# EAGLE design watchV2 (EAGLE 9.5.2)
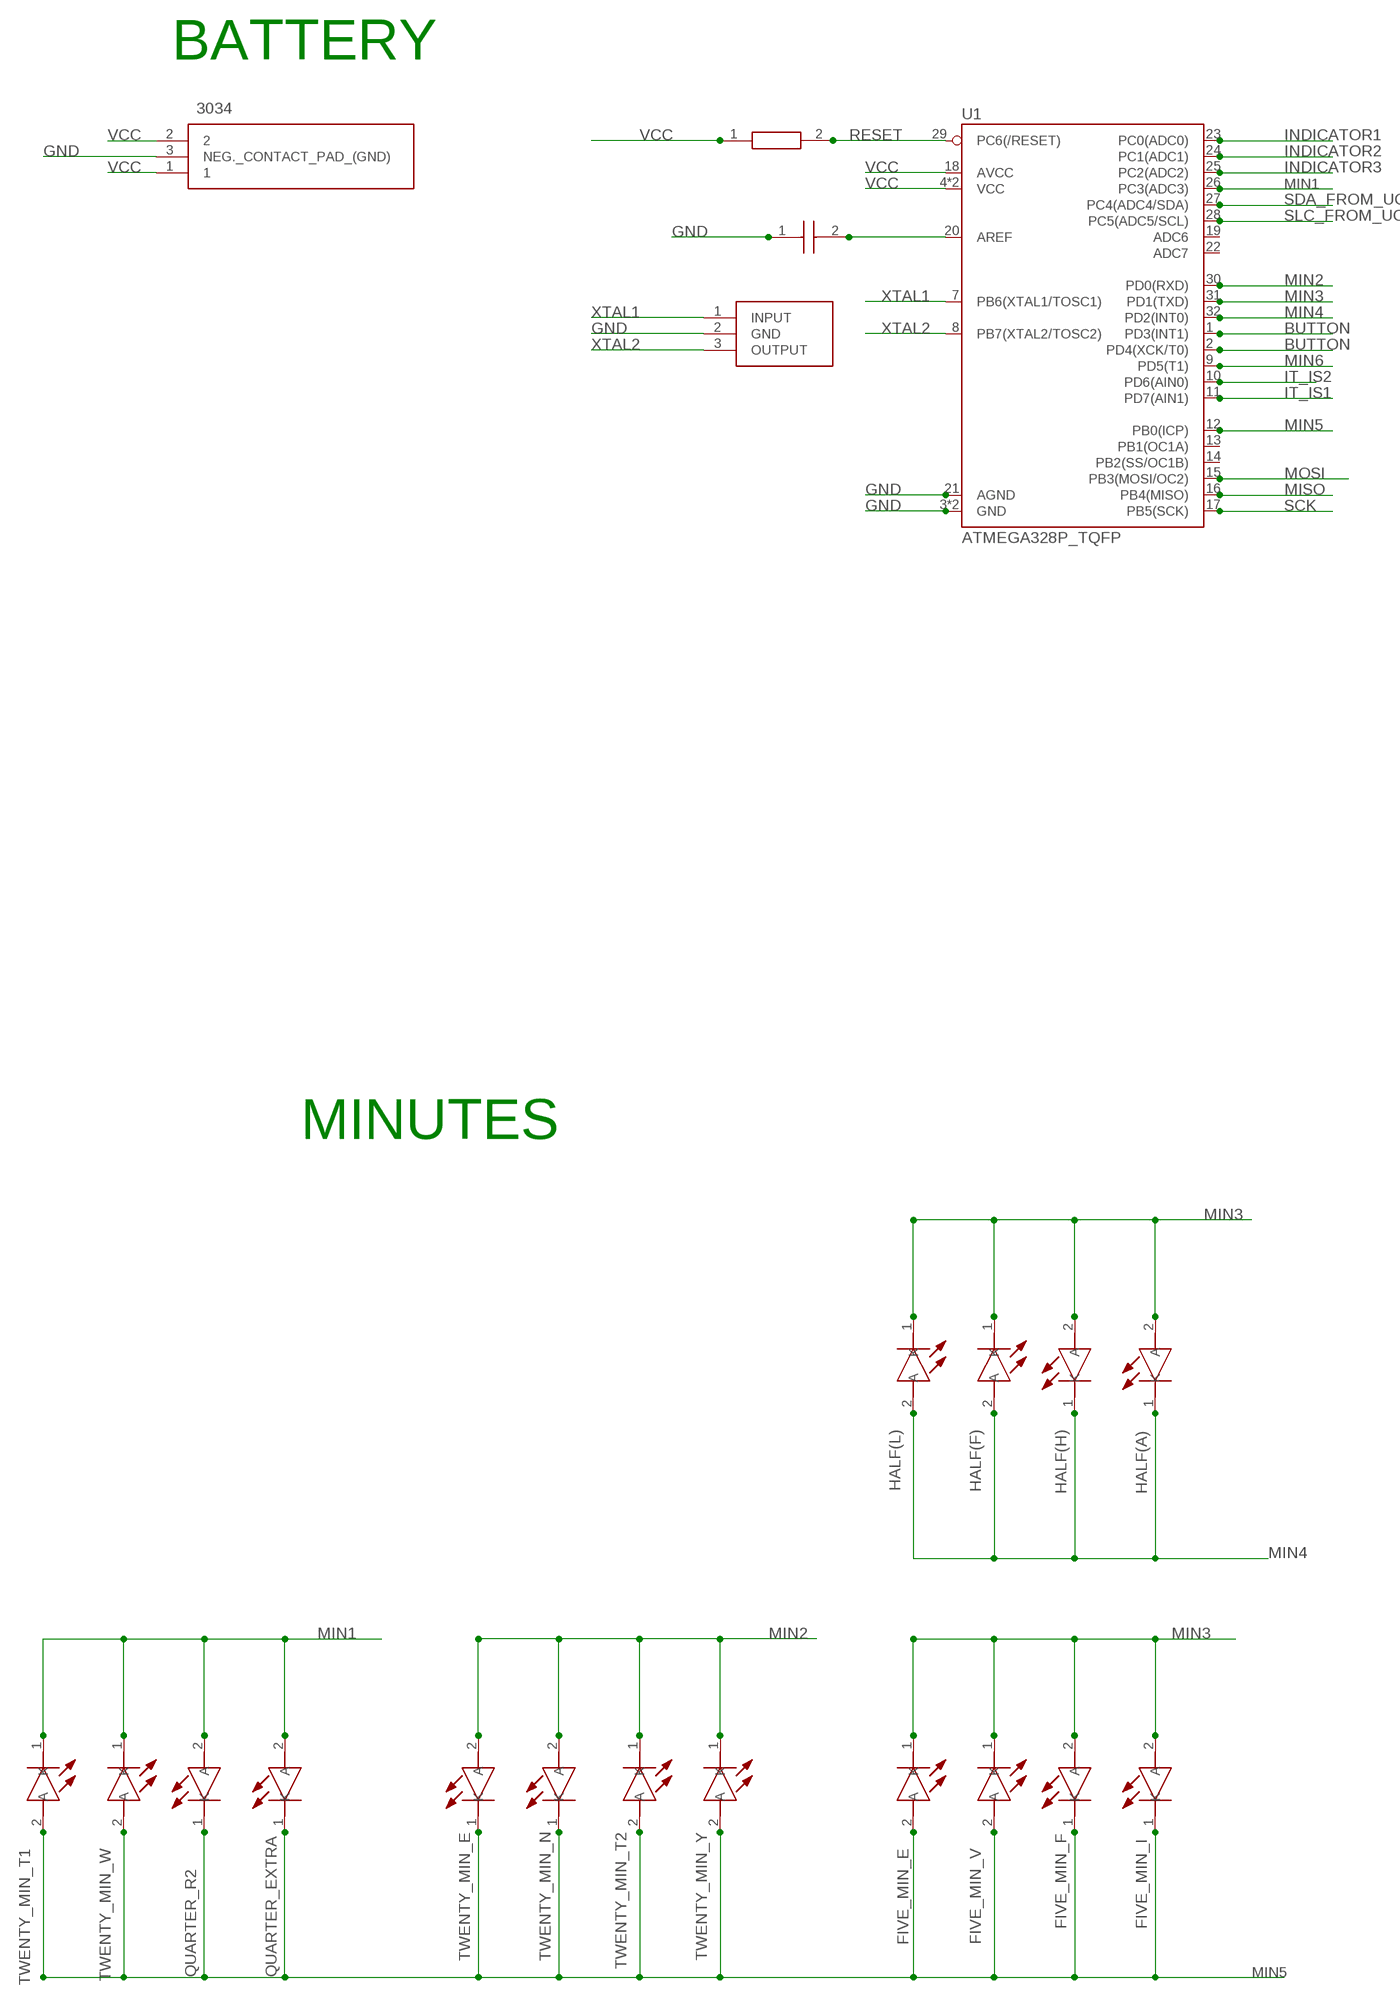
[diagram p0: schematic, sheet 1, part 1 of 3]
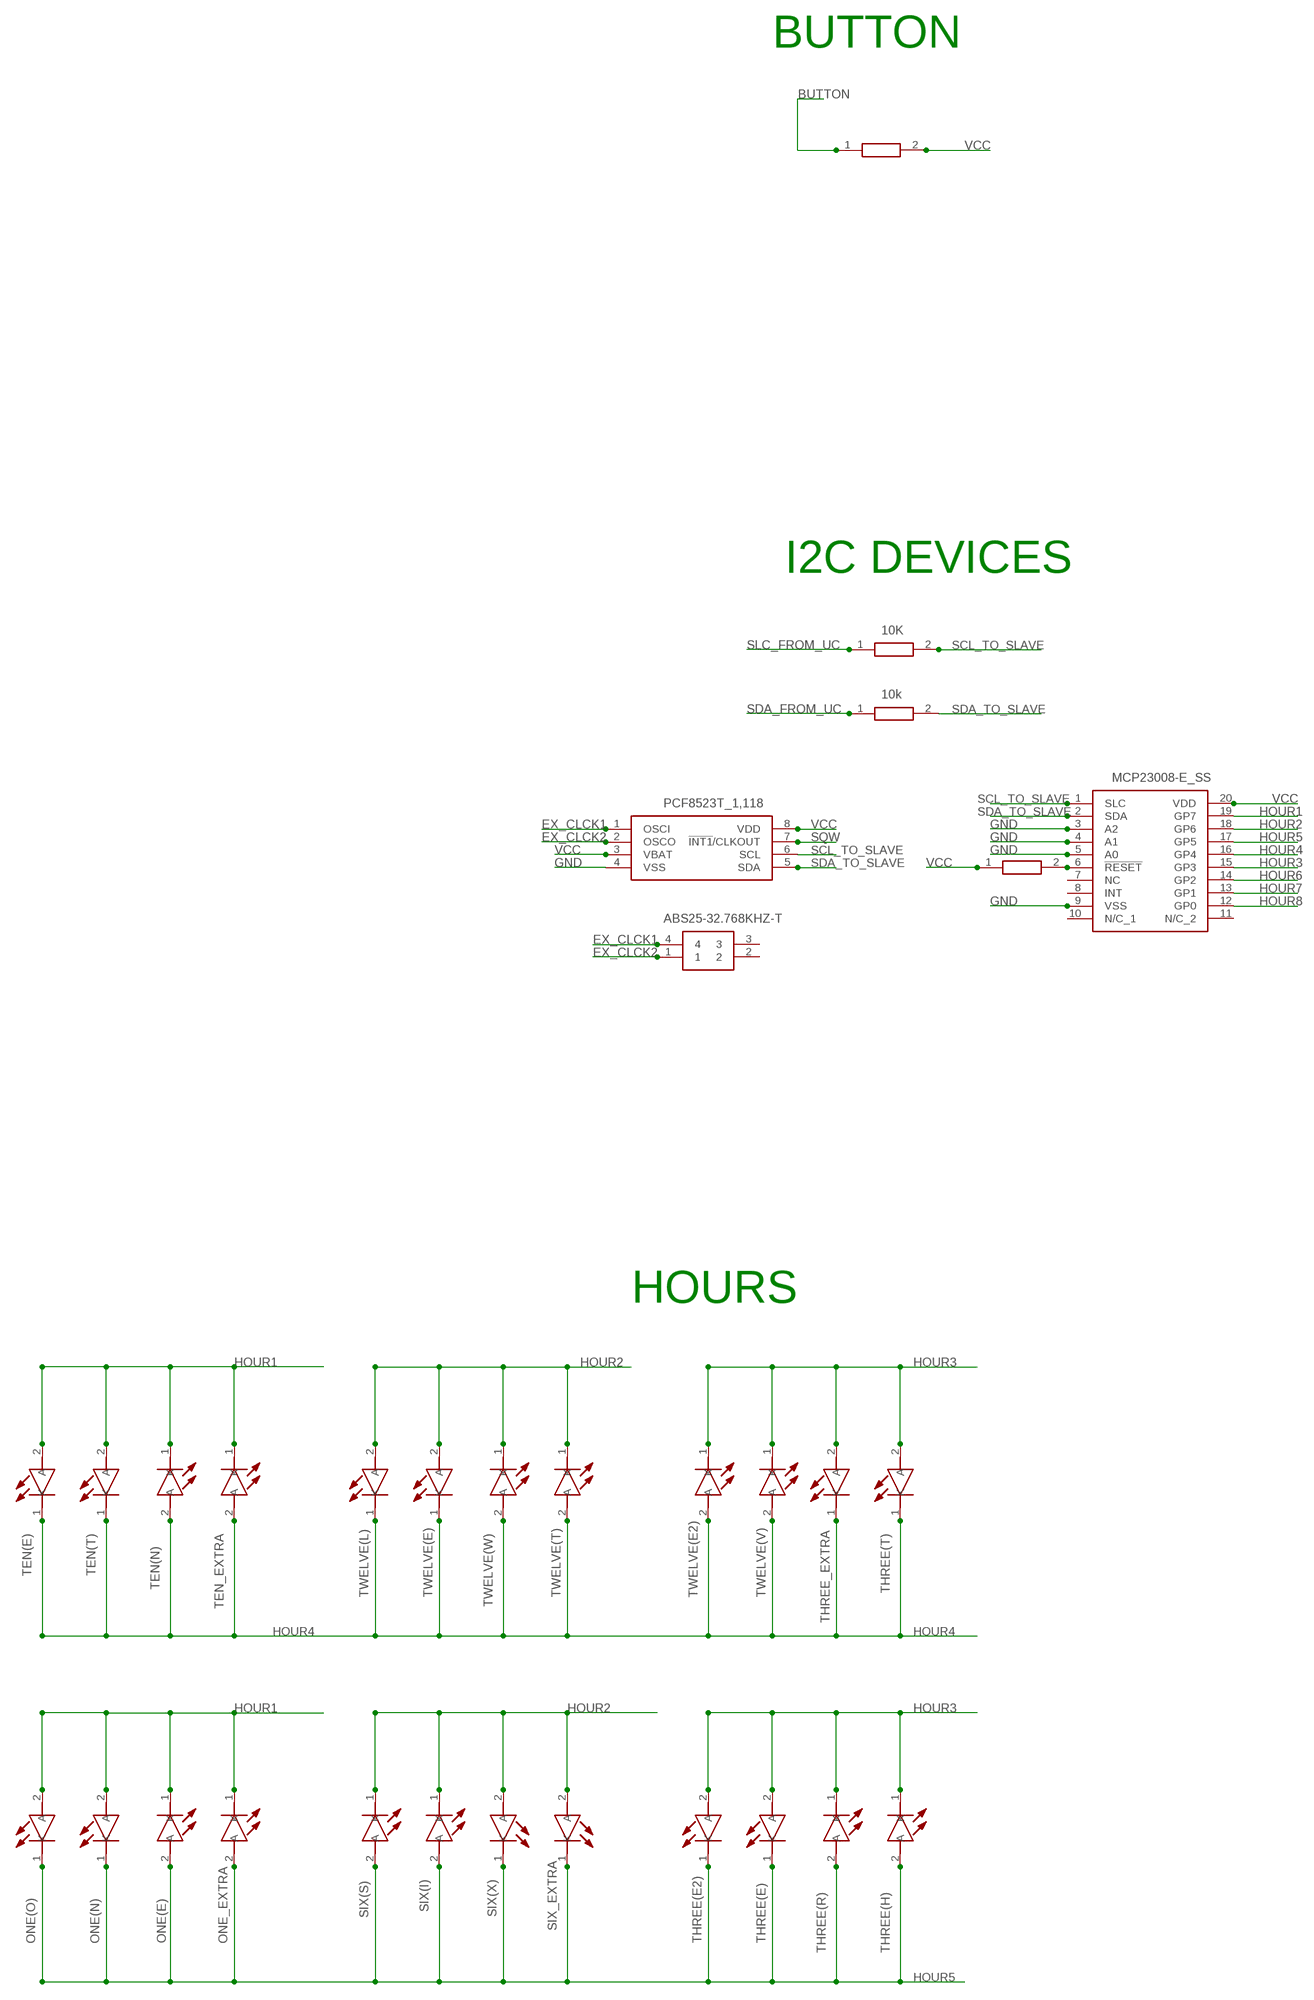
[diagram p1: schematic, sheet 1, part 2 of 3]
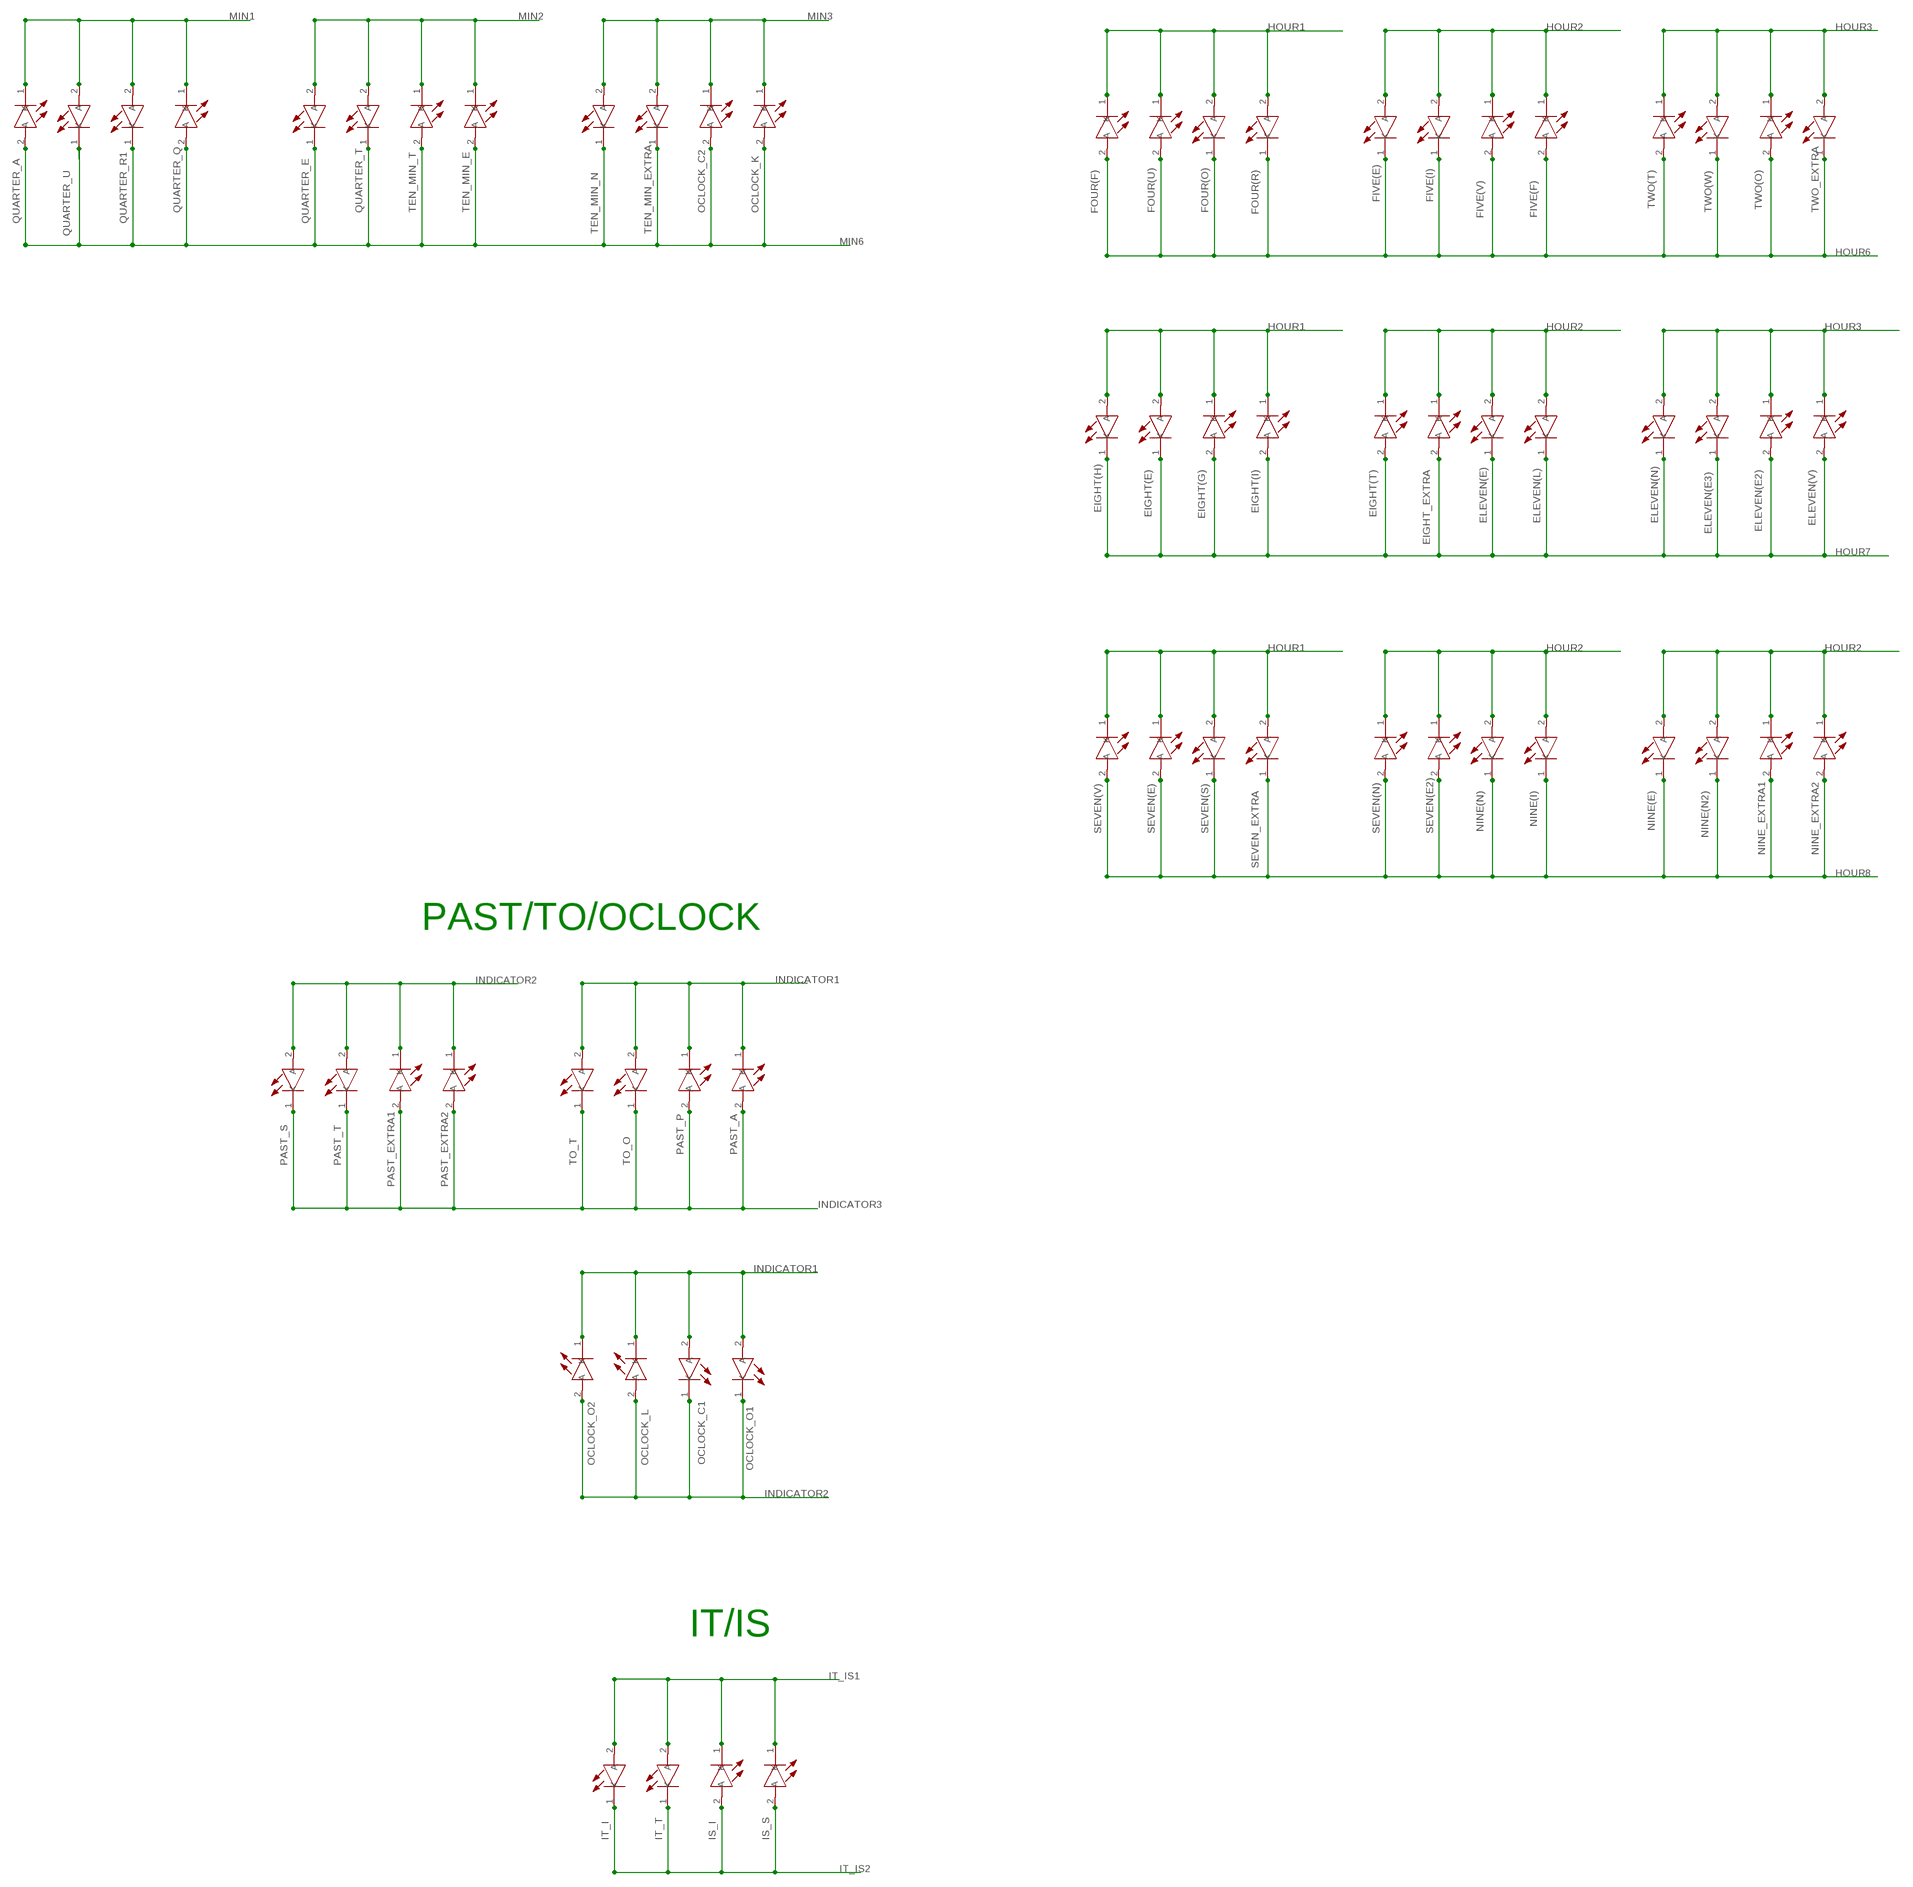
[diagram p2: schematic, sheet 1, part 3 of 3]

## Parts
10K  RC0402FR-0722RL  [RESC1005X40N]
C1  C0402C104Z4VAC  [CAPC1005X55N]
EIGHT(E)  APHHS1005CGCK  [LEDC1005X60N]
EIGHT(G)  APHHS1005CGCK  [LEDC1005X60N]
EIGHT(H)  APHHS1005CGCK  [LEDC1005X60N]
EIGHT(I)  APHHS1005CGCK  [LEDC1005X60N]
EIGHT(T)  APHHS1005CGCK  [LEDC1005X60N]
EIGHT_EXTRA  APHHS1005CGCK  [LEDC1005X60N]
ELEVEN(E2)  APHHS1005CGCK  [LEDC1005X60N]
ELEVEN(E3)  APHHS1005CGCK  [LEDC1005X60N]
ELEVEN(E)  APHHS1005CGCK  [LEDC1005X60N]
ELEVEN(L)  APHHS1005CGCK  [LEDC1005X60N]
ELEVEN(N)  APHHS1005CGCK  [LEDC1005X60N]
ELEVEN(V)  APHHS1005CGCK  [LEDC1005X60N]
FIVE(E)  APHHS1005CGCK  [LEDC1005X60N]
FIVE(F)  APHHS1005CGCK  [LEDC1005X60N]
FIVE(I)  APHHS1005CGCK  [LEDC1005X60N]
FIVE(V)  APHHS1005CGCK  [LEDC1005X60N]
FIVE_MIN_E  APHHS1005CGCK  [LEDC1005X60N]
FIVE_MIN_F  APHHS1005CGCK  [LEDC1005X60N]
FIVE_MIN_I  APHHS1005CGCK  [LEDC1005X60N]
FIVE_MIN_V  APHHS1005CGCK  [LEDC1005X60N]
FOUR(F)  APHHS1005CGCK  [LEDC1005X60N]
FOUR(O)  APHHS1005CGCK  [LEDC1005X60N]
FOUR(R)  APHHS1005CGCK  [LEDC1005X60N]
FOUR(U)  APHHS1005CGCK  [LEDC1005X60N]
HALF(A)  APHHS1005CGCK  [LEDC1005X60N]
HALF(F)  APHHS1005CGCK  [LEDC1005X60N]
HALF(H)  APHHS1005CGCK  [LEDC1005X60N]
HALF(L)  APHHS1005CGCK  [LEDC1005X60N]
IC1  MCP23008-E_SS  [SOP65P780X200-20N]
IC2  CSTNE16M0VH3C000R0  [CSTNE16M0VH3C000R0]
IC3  PCF8523T_1,118  [SOIC127P600X175-8N]
IS_I  APHHS1005CGCK  [LEDC1005X60N]
IS_S  APHHS1005CGCK  [LEDC1005X60N]
IT_I  APHHS1005CGCK  [LEDC1005X60N]
IT_T  APHHS1005CGCK  [LEDC1005X60N]
NINE(E)  APHHS1005CGCK  [LEDC1005X60N]
NINE(I)  APHHS1005CGCK  [LEDC1005X60N]
NINE(N2)  APHHS1005CGCK  [LEDC1005X60N]
NINE(N)  APHHS1005CGCK  [LEDC1005X60N]
NINE_EXTRA1  APHHS1005CGCK  [LEDC1005X60N]
NINE_EXTRA2  APHHS1005CGCK  [LEDC1005X60N]
OCLOCK_C1  APHHS1005CGCK  [LEDC1005X60N]
OCLOCK_C2  APHHS1005CGCK  [LEDC1005X60N]
OCLOCK_K  APHHS1005CGCK  [LEDC1005X60N]
OCLOCK_L  APHHS1005CGCK  [LEDC1005X60N]
OCLOCK_O1  APHHS1005CGCK  [LEDC1005X60N]
OCLOCK_O2  APHHS1005CGCK  [LEDC1005X60N]
ONE(E)  APHHS1005CGCK  [LEDC1005X60N]
ONE(N)  APHHS1005CGCK  [LEDC1005X60N]
ONE(O)  APHHS1005CGCK  [LEDC1005X60N]
ONE_EXTRA  APHHS1005CGCK  [LEDC1005X60N]
PAST_A  APHHS1005CGCK  [LEDC1005X60N]
PAST_EXTRA1  48ohm  APHHS1005CGCK  [LEDC1005X60N]
PAST_EXTRA2  APHHS1005CGCK  [LEDC1005X60N]
PAST_P  48ohm  APHHS1005CGCK  [LEDC1005X60N]
PAST_S  APHHS1005CGCK  [LEDC1005X60N]
PAST_T  APHHS1005CGCK  [LEDC1005X60N]
QUARTER_A  APHHS1005CGCK  [LEDC1005X60N]
QUARTER_E  APHHS1005CGCK  [LEDC1005X60N]
QUARTER_EXTRA  APHHS1005CGCK  [LEDC1005X60N]
QUARTER_Q  APHHS1005CGCK  [LEDC1005X60N]
QUARTER_R1  APHHS1005CGCK  [LEDC1005X60N]
QUARTER_R2  APHHS1005CGCK  [LEDC1005X60N]
QUARTER_T  APHHS1005CGCK  [LEDC1005X60N]
QUARTER_U  APHHS1005CGCK  [LEDC1005X60N]
RED1  RC0402FR-0722RL  [RESC1005X40N]
RED2  RC0402FR-0722RL  [RESC1005X40N]
RED5  RC0402FR-0722RL  [RESC1005X40N]
RED7  10k  RC0402FR-0722RL  [RESC1005X40N]
SEVEN(E2)  APHHS1005CGCK  [LEDC1005X60N]
SEVEN(E)  APHHS1005CGCK  [LEDC1005X60N]
SEVEN(N)  APHHS1005CGCK  [LEDC1005X60N]
SEVEN(S)  APHHS1005CGCK  [LEDC1005X60N]
SEVEN(V)  APHHS1005CGCK  [LEDC1005X60N]
SEVEN_EXTRA  APHHS1005CGCK  [LEDC1005X60N]
SIX(I)  APHHS1005CGCK  [LEDC1005X60N]
SIX(S)  APHHS1005CGCK  [LEDC1005X60N]
SIX(X)  APHHS1005CGCK  [LEDC1005X60N]
SIX_EXTRA  APHHS1005CGCK  [LEDC1005X60N]
TEN(E)  APHHS1005CGCK  [LEDC1005X60N]
TEN(N)  APHHS1005CGCK  [LEDC1005X60N]
TEN(T)  APHHS1005CGCK  [LEDC1005X60N]
TEN_EXTRA  APHHS1005CGCK  [LEDC1005X60N]
TEN_MIN_E  APHHS1005CGCK  [LEDC1005X60N]
TEN_MIN_EXTRA  APHHS1005CGCK  [LEDC1005X60N]
TEN_MIN_N  APHHS1005CGCK  [LEDC1005X60N]
TEN_MIN_T  APHHS1005CGCK  [LEDC1005X60N]
THREE(E2)  APHHS1005CGCK  [LEDC1005X60N]
THREE(E)  APHHS1005CGCK  [LEDC1005X60N]
THREE(H)  APHHS1005CGCK  [LEDC1005X60N]
THREE(R)  APHHS1005CGCK  [LEDC1005X60N]
THREE(T)  APHHS1005CGCK  [LEDC1005X60N]
THREE_EXTRA  APHHS1005CGCK  [LEDC1005X60N]
TO_O  APHHS1005CGCK  [LEDC1005X60N]
TO_T  APHHS1005CGCK  [LEDC1005X60N]
TWELVE(E2)  APHHS1005CGCK  [LEDC1005X60N]
TWELVE(E)  APHHS1005CGCK  [LEDC1005X60N]
TWELVE(L)  APHHS1005CGCK  [LEDC1005X60N]
TWELVE(T)  APHHS1005CGCK  [LEDC1005X60N]
TWELVE(V)  APHHS1005CGCK  [LEDC1005X60N]
TWELVE(W)  APHHS1005CGCK  [LEDC1005X60N]
TWENTY_MIN_E  APHHS1005CGCK  [LEDC1005X60N]
TWENTY_MIN_N  APHHS1005CGCK  [LEDC1005X60N]
TWENTY_MIN_T1  APHHS1005CGCK  [LEDC1005X60N]
TWENTY_MIN_T2  APHHS1005CGCK  [LEDC1005X60N]
TWENTY_MIN_W  APHHS1005CGCK  [LEDC1005X60N]
TWENTY_MIN_Y  APHHS1005CGCK  [LEDC1005X60N]
TWO(O)  APHHS1005CGCK  [LEDC1005X60N]
TWO(T)  APHHS1005CGCK  [LEDC1005X60N]
TWO(W)  APHHS1005CGCK  [LEDC1005X60N]
TWO_EXTRA  APHHS1005CGCK  [LEDC1005X60N]
U1  ATMEGA328P_TQFP  [TQFP32-08]
U2  3034  [3034]
Y1  ABS25-32.768KHZ-T  [ABS2532768KHZT]

## Nets
BUTTON: RED1.1 U1.1(PD3(INT1)) U1.2(PD4(XCK/T0))
EX_CLCK1: IC3.1(OSCI) Y1.4
EX_CLCK2: IC3.2(OSCO) Y1.1
GND: C1.1 IC1.3(A2) IC1.4(A1) IC1.5(A0) IC1.9(VSS) IC2.2(GND) IC3.4(VSS) U1.3(GND) U1.5(GND) U1.21(AGND) U2.3(NEG._CONTACT_PAD_(GND))
HOUR1: EIGHT(E).2(A) EIGHT(G).1(K) EIGHT(H).2(A) EIGHT(I).1(K) FOUR(F).1(K) FOUR(O).2(A) FOUR(R).2(A) FOUR(U).1(K) IC1.19(GP7) ONE(E).1(K) ONE(N).2(A) ONE(O).2(A) ONE_EXTRA.1(K) SEVEN(E).1(K) SEVEN(S).2(A) SEVEN(V).1(K) SEVEN_EXTRA.2(A) TEN(E).2(A) TEN(N).1(K) TEN(T).2(A) TEN_EXTRA.1(K)
HOUR2: EIGHT(T).1(K) EIGHT_EXTRA.1(K) ELEVEN(E).2(A) ELEVEN(L).2(A) FIVE(E).2(A) FIVE(F).1(K) FIVE(I).2(A) FIVE(V).1(K) IC1.18(GP6) NINE(E).2(A) NINE(I).2(A) NINE(N2).2(A) NINE(N).2(A) NINE_EXTRA1.1(K) NINE_EXTRA2.1(K) SEVEN(E2).1(K) SEVEN(N).1(K) SIX(I).1(K) SIX(S).1(K) SIX(X).2(A) SIX_EXTRA.2(A) TWELVE(E).2(A) TWELVE(L).2(A) TWELVE(T).1(K) TWELVE(W).1(K)
HOUR3: ELEVEN(E2).1(K) ELEVEN(E3).2(A) ELEVEN(N).2(A) ELEVEN(V).1(K) IC1.15(GP3) THREE(E2).2(A) THREE(E).2(A) THREE(H).1(K) THREE(R).1(K) THREE(T).2(A) THREE_EXTRA.2(A) TWELVE(E2).1(K) TWELVE(V).1(K) TWO(O).1(K) TWO(T).1(K) TWO(W).2(A) TWO_EXTRA.2(A)
HOUR4: IC1.16(GP4) TEN(E).1(K) TEN(N).2(A) TEN(T).1(K) TEN_EXTRA.2(A) THREE(T).1(K) THREE_EXTRA.1(K) TWELVE(E2).2(A) TWELVE(E).1(K) TWELVE(L).1(K) TWELVE(T).2(A) TWELVE(V).2(A) TWELVE(W).2(A)
HOUR5: IC1.17(GP5) ONE(E).2(A) ONE(N).1(K) ONE(O).1(K) ONE_EXTRA.2(A) SIX(I).2(A) SIX(S).2(A) SIX(X).1(K) SIX_EXTRA.1(K) THREE(E2).1(K) THREE(E).1(K) THREE(H).2(A) THREE(R).2(A)
HOUR6: FIVE(E).1(K) FIVE(F).2(A) FIVE(I).1(K) FIVE(V).2(A) FOUR(F).2(A) FOUR(O).1(K) FOUR(R).1(K) FOUR(U).2(A) IC1.14(GP2) TWO(O).2(A) TWO(T).2(A) TWO(W).1(K) TWO_EXTRA.1(K)
HOUR7: EIGHT(E).1(K) EIGHT(G).2(A) EIGHT(H).1(K) EIGHT(I).2(A) EIGHT(T).2(A) EIGHT_EXTRA.2(A) ELEVEN(E2).2(A) ELEVEN(E3).1(K) ELEVEN(E).1(K) ELEVEN(L).1(K) ELEVEN(N).1(K) ELEVEN(V).2(A) IC1.13(GP1)
HOUR8: IC1.12(GP0) NINE(E).1(K) NINE(I).1(K) NINE(N2).1(K) NINE(N).1(K) NINE_EXTRA1.2(A) NINE_EXTRA2.2(A) SEVEN(E2).2(A) SEVEN(E).2(A) SEVEN(N).2(A) SEVEN(S).1(K) SEVEN(V).2(A) SEVEN_EXTRA.1(K)
INDICATOR1: OCLOCK_C1.2(A) OCLOCK_L.1(K) OCLOCK_O1.2(A) OCLOCK_O2.1(K) PAST_A.1(K) PAST_P.1(K) TO_O.2(A) TO_T.2(A) U1.23(PC0(ADC0))
INDICATOR2: OCLOCK_C1.1(K) OCLOCK_L.2(A) OCLOCK_O1.1(K) OCLOCK_O2.2(A) PAST_EXTRA1.1(K) PAST_EXTRA2.1(K) PAST_S.2(A) PAST_T.2(A) U1.24(PC1(ADC1))
INDICATOR3: PAST_A.2(A) PAST_EXTRA1.2(A) PAST_EXTRA2.2(A) PAST_P.2(A) PAST_S.1(K) PAST_T.1(K) TO_O.1(K) TO_T.1(K) U1.25(PC2(ADC2))
IT_IS1: IS_I.1(K) IS_S.1(K) IT_I.2(A) IT_T.2(A) U1.11(PD7(AIN1))
IT_IS2: IS_I.2(A) IS_S.2(A) IT_I.1(K) IT_T.1(K) U1.10(PD6(AIN0))
MIN1: QUARTER_A.1(K) QUARTER_EXTRA.2(A) QUARTER_Q.1(K) QUARTER_R1.2(A) QUARTER_R2.2(A) QUARTER_U.2(A) TWENTY_MIN_T1.1(K) TWENTY_MIN_W.1(K) U1.26(PC3(ADC3))
MIN2: QUARTER_E.2(A) QUARTER_T.2(A) TEN_MIN_E.1(K) TEN_MIN_T.1(K) TWENTY_MIN_E.2(A) TWENTY_MIN_N.2(A) TWENTY_MIN_T2.1(K) TWENTY_MIN_Y.1(K) U1.30(PD0(RXD))
MIN3: FIVE_MIN_E.1(K) FIVE_MIN_F.2(A) FIVE_MIN_I.2(A) FIVE_MIN_V.1(K) HALF(A).2(A) HALF(F).1(K) HALF(H).2(A) HALF(L).1(K) OCLOCK_C2.1(K) OCLOCK_K.1(K) TEN_MIN_EXTRA.2(A) TEN_MIN_N.2(A) U1.31(PD1(TXD))
MIN4: HALF(A).1(K) HALF(F).2(A) HALF(H).1(K) HALF(L).2(A) U1.32(PD2(INT0))
MIN5: FIVE_MIN_E.2(A) FIVE_MIN_F.1(K) FIVE_MIN_I.1(K) FIVE_MIN_V.2(A) QUARTER_EXTRA.1(K) QUARTER_R2.1(K) TWENTY_MIN_E.1(K) TWENTY_MIN_N.1(K) TWENTY_MIN_T1.2(A) TWENTY_MIN_T2.2(A) TWENTY_MIN_W.2(A) TWENTY_MIN_Y.2(A) U1.12(PB0(ICP))
MIN6: OCLOCK_C2.2(A) OCLOCK_K.2(A) QUARTER_A.2(A) QUARTER_E.1(K) QUARTER_Q.2(A) QUARTER_R1.1(K) QUARTER_T.1(K) QUARTER_U.1(K) TEN_MIN_E.2(A) TEN_MIN_EXTRA.1(K) TEN_MIN_N.1(K) TEN_MIN_T.2(A) U1.9(PD5(T1))
MISO: U1.16(PB4(MISO))
MOSI: U1.15(PB3(MOSI/OC2))
N$1: IC1.6(!RESET) RED2.2
N$42: C1.2 U1.20(AREF)
RESET: RED5.2 U1.29(PC6(/RESET))
SCK: U1.17(PB5(SCK))
SCL_TO_SLAVE: 10K.2 IC1.1(SLC) IC3.6(SCL)
SDA_FROM_UC: RED7.1 U1.27(PC4(ADC4/SDA))
SDA_TO_SLAVE: IC1.2(SDA) IC3.5(SDA) RED7.2
SLC_FROM_UC: 10K.1 U1.28(PC5(ADC5/SCL))
SQW: IC3.7(!INT1!/CLKOUT)
VCC: IC1.20(VDD) IC3.3(VBAT) IC3.8(VDD) RED1.2 RED2.1 RED5.1 U1.4(VCC) U1.6(VCC) U1.18(AVCC) U2.1 U2.2
XTAL1: IC2.1(INPUT) U1.7(PB6(XTAL1/TOSC1))
XTAL2: IC2.3(OUTPUT) U1.8(PB7(XTAL2/TOSC2))
Unconnected: IC1.7(NC) IC1.8(INT) IC1.10(N/C_1) IC1.11(N/C_2) U1.13(PB1(OC1A)) U1.14(PB2(SS/OC1B)) U1.19(ADC6) U1.22(ADC7) Y1.2 Y1.3

## Notes on the sheet
- BUTTON
- BATTERY
- I2C DEVICES
- HOURS
- MINUTES
- PAST/TO/OCLOCK
- IT/IS

## Library data of the parts
10K RED1 RED2 RED5 RED7 = SamacSys_Parts:RC0402FR-0722RL: YAGEO (PHYCOMP) - RC0402FR-0722RL - RES, THICK FILM, 22R, 1%, 0.063W, 0402 Source: Datasheet <https://componentsearchengine.com/Datasheets/1/RC0402FR-0722RL.pdf>; DESCRIPTION: YAGEO (PHYCOMP) - RC0402FR-0722RL - RES, THICK FILM, 22R, 1%, 0.063W, 0402; HEIGHT: 0.4mm; MANUFACTURER_NAME: YAGEO (PHYCOMP); MANUFACTURER_PART_NUMBER: RC0402FR-0722RL; MOUSER_PART_NUMBER: 603-RC0402FR-0722RL; MOUSER_PRICE-STOCK: https://www.mouser.com/Search/Refine.aspx?Keyword=603-RC0402FR-0722RL
C1 = C0402C104Z4VAC:C0402C104Z4VAC: Multilayer Ceramic Capacitors MLCC - SMD/SMT 16volts 0.1uF Y5V Source: Datasheet; DESCRIPTION: Multilayer Ceramic Capacitors MLCC - SMD/SMT 16volts 0.1uF Y5V; HEIGHT: 0.55mm; MANUFACTURER_NAME: Kemet; MANUFACTURER_PART_NUMBER: C0402C104Z4VAC; MOUSER_PART_NUMBER: 80-C0402C104Z4VAC; MOUSER_PRICE-STOCK: https://www.mouser.co.uk/ProductDetail/KEMET/C0402C104Z4VAC?qs=sykUljcfnH0lxjRVltIu6A%3D%3D
EIGHT(E) EIGHT(G) EIGHT(H) EIGHT(I) EIGHT(T) EIGHT_EXTRA ELEVEN(E2) ELEVEN(E3) ELEVEN(E) ELEVEN(L) ELEVEN(N) ELEVEN(V) FIVE(E) FIVE(F) FIVE(I) FIVE(V) FIVE_MIN_E FIVE_MIN_F FIVE_MIN_I FIVE_MIN_V FOUR(F) FOUR(O) FOUR(R) FOUR(U) HALF(A) HALF(F) HALF(H) HALF(L) IS_I IS_S IT_I IT_T NINE(E) NINE(I) NINE(N2) NINE(N) NINE_EXTRA1 NINE_EXTRA2 OCLOCK_C1 OCLOCK_C2 OCLOCK_K OCLOCK_L OCLOCK_O1 OCLOCK_O2 ONE(E) ONE(N) ONE(O) ONE_EXTRA PAST_A PAST_EXTRA1 PAST_EXTRA2 PAST_P PAST_S PAST_T QUARTER_A QUARTER_E QUARTER_EXTRA QUARTER_Q QUARTER_R1 QUARTER_R2 QUARTER_T QUARTER_U SEVEN(E2) SEVEN(E) SEVEN(N) SEVEN(S) SEVEN(V) SEVEN_EXTRA SIX(I) SIX(S) SIX(X) SIX_EXTRA TEN(E) TEN(N) TEN(T) TEN_EXTRA TEN_MIN_E TEN_MIN_EXTRA TEN_MIN_N TEN_MIN_T THREE(E2) THREE(E) THREE(H) THREE(R) THREE(T) THREE_EXTRA TO_O TO_T TWELVE(E2) TWELVE(E) TWELVE(L) TWELVE(T) TWELVE(V) TWELVE(W) TWENTY_MIN_E TWENTY_MIN_N TWENTY_MIN_T1 TWENTY_MIN_T2 TWENTY_MIN_W TWENTY_MIN_Y TWO(O) TWO(T) TWO(W) TWO_EXTRA = SamacSys_Parts:APHHS1005CGCK: Kingbright APHHS1005CGCK, APHHS1005 Series Green LED, 570 nm, 1005 (0402) Clear, Rectangle Lens SMD Package Source: Datasheet <https://componentsearchengine.com/Datasheets/1/APHHS1005CGCK.pdf>; DESCRIPTION: Kingbright APHHS1005CGCK, APHHS1005 Series Green LED, 570 nm, 1005 (0402) Clear, Rectangle Lens SMD Package; HEIGHT: 0.6mm; MANUFACTURER_NAME: Kingbright; MANUFACTURER_PART_NUMBER: APHHS1005CGCK; MOUSER_PART_NUMBER: 604-APHHS1005CGCK; MOUSER_PRICE-STOCK: https://www.mouser.com/Search/Refine.aspx?Keyword=604-APHHS1005CGCK
IC1 = MCP23008-E_SS:MCP23008-E_SS: 8-Bit I/O Port Expander I2C 1.7M SSOP20 Microchip MCP23008-E/SS, 8-channel 8bit I/O Expander 1.7MHz, I2C, 20-Pin SSOP Source: Datasheet; DESCRIPTION: 8-Bit I/O Port Expander I2C 1.7M SSOP20 Microchip MCP23008-E/SS, 8-channel 8bit I/O Expander 1.7MHz, I2C, 20-Pin SSOP; HEIGHT: 2mm; MANUFACTURER_NAME: Microchip; MANUFACTURER_PART_NUMBER: MCP23008-E/SS; MOUSER_PART_NUMBER: 579-MCP23008-E/SS; MOUSER_PRICE-STOCK: https://www.mouser.co.uk/ProductDetail/Microchip-Technology/MCP23008-E-SS?qs=Sez7gRs8XSU%2FXF8up%2FiqvA%3D%3D
IC2 = CSTNE16M0VH3C000R0:CSTNE16M0VH3C000R0: Resonators 16.0000MHz 15pF SMD CHP Rsntr 0.07% AUTO Source: Datasheet <https://www.murata.com/en-eu/products/productdata/8801162264606/SPEC-CSTNE16M0VH3C000R0.pdf?1519875007000>; DESCRIPTION: Resonators 16.0000MHz 15pF SMD CHP Rsntr 0.07% AUTO; HEIGHT: 1mm; MANUFACTURER_NAME: Murata Electronics; MANUFACTURER_PART_NUMBER: CSTNE16M0VH3C000R0; MOUSER_PART_NUMBER: 81-CSTNE16M0VH3C000R; MOUSER_PRICE-STOCK: https://www.mouser.co.uk/ProductDetail/Murata-Electronics/CSTNE16M0VH3C000R0?qs=y6ZabgHbY%252BxKpaBi77VCSg%3D%3D
IC3 = PCF8523T_1_118:PCF8523T_1,118: NXP - PCF8523T/1,118 - REAL TIME CLOCK/CALENDAR, I2C, SOIC-8 Source: Datasheet <http://www.nxp.com/docs/en/data-sheet/PCF8523.pdf>; DESCRIPTION: NXP - PCF8523T/1,118 - REAL TIME CLOCK/CALENDAR, I2C, SOIC-8; HEIGHT: 1.75mm; MANUFACTURER_NAME: NXP; MANUFACTURER_PART_NUMBER: PCF8523T/1,118; MOUSER_PART_NUMBER: 771-PCF8523T/1118; MOUSER_PRICE-STOCK: https://www.mouser.co.uk/ProductDetail/NXP-Semiconductors/PCF8523T-1118?qs=beN0Cyoe8YmmXShRMIPCwg%3D%3D
U1 = SparkFun-IC-Microcontroller:ATMEGA328P_TQFP: Popular 328P in QFP Storefront component: ATmega328 - TQFP <https://www.sparkfun.com/products/13448> (COM-13448) Datasheet <http://www.sparkfun.com/datasheets/Components/SMD/ATMega328.pdf> SparkFun Products SparkFun RedBoard - Programmed with Arduino <https://www.sparkfun.com/products/12757> (DEV-12757) Arduino Pro Mini 328 - 5V/16MHz <https://www.sparkfun.com/products/11113> (DEV-11113) Arduino Pro Mini 328 - 3.3V/8MHz <https://www.sparkfun.com/products/11114> (DEV-11114) SparkFun OpenLog <https://www.sparkfun.com/products/13712> (DEV-13712) SparkFun MicroView - OLED Arduino Module <https://www.sparkfun.com/products/12923> (DEV-12923) SparkFun Digital Sandbox <https://www.sparkfun.com/products/12651> (DEV-12651) SparkFun PicoBoard <https://www.sparkfun.com/products/11888> (WIG-11888) Arduino Fio <https://www.sparkfun.com/products/10116> (DEV-10116) LilyPad Arduino 328 Main Board <https://www.sparkfun.com/products/13342> (DEV-13342) SparkFun RedStick <https://www.sparkfun.com/products/13741> (DEV-13741) LilyPad MP3 <https://www.sparkfun.com/products/11013> (DEV-11013) LilyPad Arduino SimpleSnap <https://www.sparkfun.com/products/10941> (DEV-10941) SparkFun Stepoko <https://www.sparkfun.com/products/13899> (ROB-13899) SparkFun Geiger Counter <https://www.sparkfun.com/products/11345> (SEN-11345) SparkFun EL Sequencer <https://www.sparkfun.com/products/12781> (COM-12781) Arduino Pro 328 - 5V/16MHz <https://www.sparkfun.com/products/10915> (DEV-10915) CryptoCape <https://www.sparkfun.com/products/12773> (DEV-12773) SparkFun IR Thermometer Evaluation Board - MLX90614 <https://www.sparkfun.com/products/10740> (SEN-10740) SparkFun RedBot Mainboard <https://www.sparkfun.com/products/12097> (ROB-12097) Arduino Pro 328 - 3.3V/8MHz <https://www.sparkfun.com/products/10914> (DEV-10914) SparkFun Block for Intel® Edison - Arduino <https://www.sparkfun.com/products/13036> (DEV-13036) SparkFun Simon Says - Surface Mount Soldering Kit <https://www.sparkfun.com/products/10935> (KIT-10935) SparkFun 7-Segment Serial Display - Red <https://www.sparkfun.com/products/11441> (COM-11441) SparkFun 7-Segment Serial Display - White <https://www.sparkfun.com/products/11629> (COM-11629) SparkFun 7-Segment Serial Display - Yellow <https://www.sparkfun.com/products/11443> (COM-11443) SparkFun 7-Segment Serial Display - Kelly Green <https://www.sparkfun.com/products/11440> (COM-11440) SparkFun 7-Segment Serial Display - Blue <https://www.sparkfun.com/products/11442> (COM-11442) SparkFun OpenSegment Serial Display - 20mm (Blue) <https://www.sparkfun.com/products/11647> (COM-11647) SparkFun OpenSegment Serial Display - 20mm (Green) <https://www.sparkfun.com/products/11646> (COM-11646) SparkFun OpenSegment Serial Display - 20mm (White) <https://www.sparkfun.com/products/11648> (COM-11648) SparkFun OpenSegment Serial Display - 20mm (Red) <https://www.sparkfun.com/products/11644> (COM-11644) SparkFun OpenSegment Serial Display - 20mm (Yellow) <https://www.sparkfun.com/products/11645> (COM-11645) SparkFun OpenSegment Shield <https://www.sparkfun.com/products/13190> (DEV-13190); PROD_ID: IC-09069
U2 = cr2032_holder:3034: Coin Cell Battery Holders COIN CELL RETAINER Source: Datasheet <http://www.keyelco.com/product-pdf.cfm?p=798>; DESCRIPTION: Coin Cell Battery Holders COIN CELL RETAINER; HEIGHT: 4.06mm; MANUFACTURER_NAME: Keystone Electronics; MANUFACTURER_PART_NUMBER: 3034; MOUSER_PART_NUMBER: 534-3034; MOUSER_PRICE-STOCK: https://www.mouser.co.uk/ProductDetail/Keystone-Electronics/3034/?qs=LDXARy4xNQtGYr6pIAv90A%3D%3D
Y1 = ABS25-32.768KHZ-T:ABS25-32.768KHZ-T: ABRACON - ABS25-32.768KHZ-T - CRYSTAL, 32.768K, 12.5PF CL 8X2.5 SMD Source: Datasheet <http://www.abracon.com/Resonators/abs25.pdf>; DESCRIPTION: ABRACON - ABS25-32.768KHZ-T - CRYSTAL, 32.768K, 12.5PF CL 8X2.5 SMD; HEIGHT: 2mm; MANUFACTURER_NAME: ABRACON; MANUFACTURER_PART_NUMBER: ABS25-32.768KHZ-T; MOUSER_PART_NUMBER: 815-ABS25-32.768KHZT; MOUSER_PRICE-STOCK: https://www.mouser.co.uk/ProductDetail/ABRACON/ABS25-32768KHZ-T?qs=2xLVn2jvFusfExB%252ByZEnpA%3D%3D

## Board
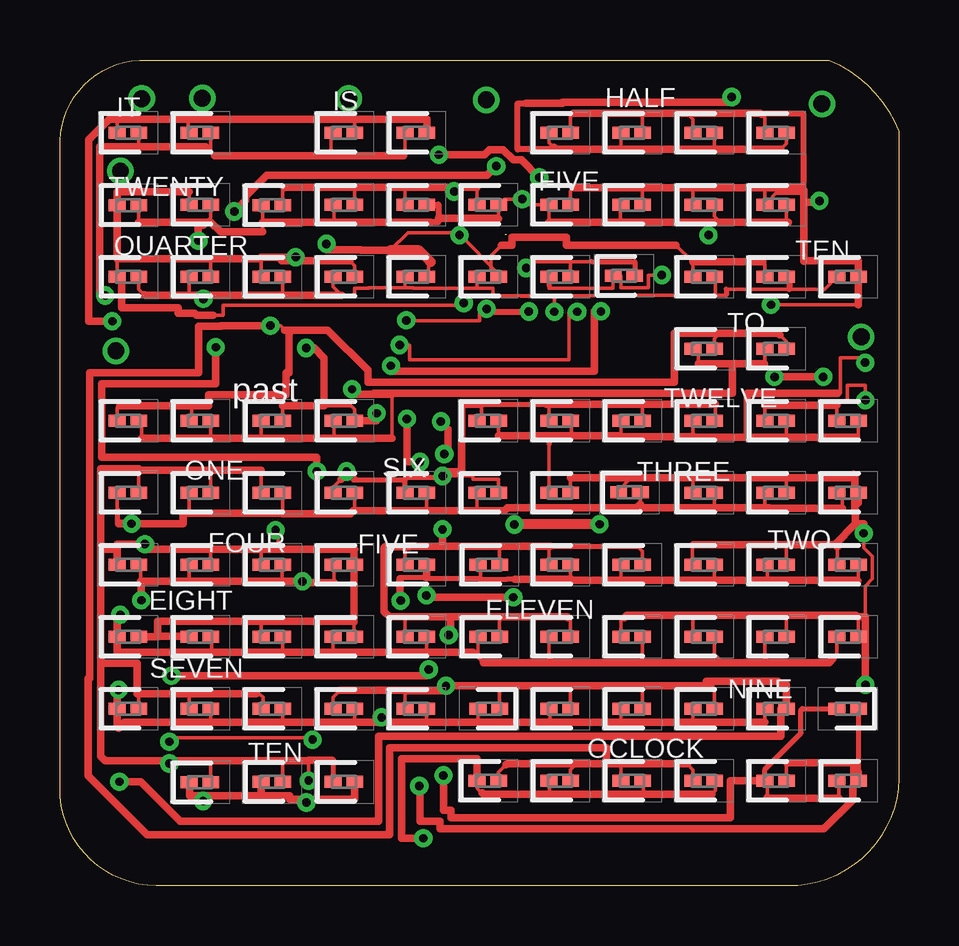
[diagram p3: board, top side]
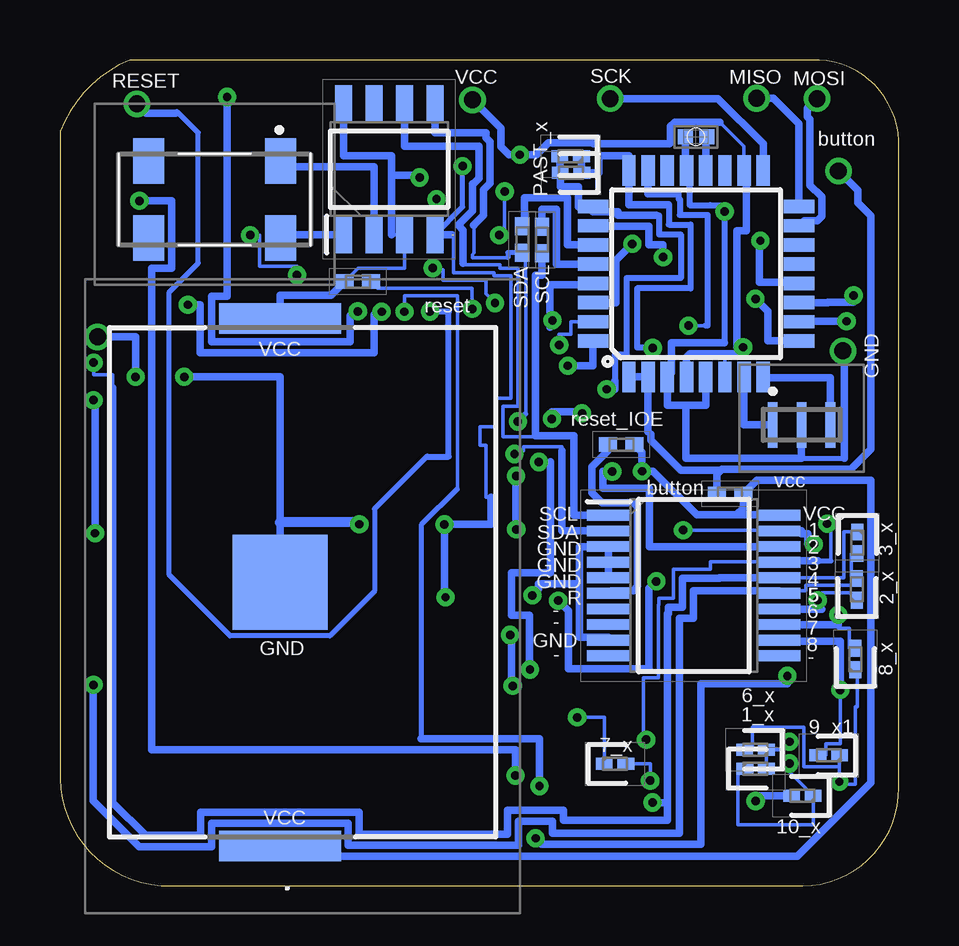
[diagram p4: board, bottom side, seen from below]

Size 34.97 x 34.41 mm. Coordinates in mm from the lower left corner, seen from the top.
Outline: 0,4.09 0,31.05 arc-90 3.64,34.41 32.07,34.41 arc-45 34.97,31.43 34.97,4.47 arc-90 30.34,0 4.01,0 arc-90 0,4.09
Copper layers (1*16): Top 0.035mm / dielectric 1.5mm / Bottom 0.035mm
Design rules "default": minimum track width 6mil, minimum drill 0.35mm, track to track 6mil, track to pad 6mil, pad to pad 6mil, via to via 6mil, smd to smd 6mil, copper to edge 40mil, drill to drill 6mil, minimum pad ring 10mil, minimum via ring 8mil, stop-mask expansion 4mil, vias tented up to drill 0mil, thermal gap 10mil

### Footprints (pad centres in the part's own frame; a part is rotated, then mirrored left to right if it is on the bottom)
RESC1005X40N = smd 0.75 x 0.6: 1 -0.55,0; 2 0.55,0
CAPC1005X55N = smd 0.62 x 0.62: 1 -0.45,0; 2 0.45,0
LEDC1005X60N = smd 0.7 x 0.5: 1 -0.45,0; 2 0.45,0
SOP65P780X200-20N = smd 1.8 x 0.45: 1 -3.55,2.925; 2 -3.55,2.275; 3 -3.55,1.625; 4 -3.55,0.975; 5 -3.55,0.325; 6 -3.55,-0.325; 7 -3.55,-0.975; 8 -3.55,-1.625; 9 -3.55,-2.275; 10 -3.55,-2.925; 11 3.55,-2.925; 12 3.55,-2.275; 13 3.55,-1.625; 14 3.55,-0.975; 15 3.55,-0.325; 16 3.55,0.325; 17 3.55,0.975; 18 3.55,1.625; 19 3.55,2.275; 20 3.55,2.925
CSTNE16M0VH3C000R0 = smd 0.4 x 1.9: 1 -1.2,-0.425; 2 0,-0.425; 3 1.2,-0.425
SOIC127P600X175-8N = smd 1.55 x 0.7: 1 -2.725,1.905; 2 -2.725,0.635; 3 -2.725,-0.635; 4 -2.725,-1.905; 5 2.725,-1.905; 6 2.725,-0.635; 7 2.725,0.635; 8 2.725,1.905
TQFP32-08 = smd 1.27 x 0.559: 1 -4.293,2.8; 2 -4.293,2; 3 -4.293,1.2; 4 -4.293,0.4; 5 -4.293,-0.4; 6 -4.293,-1.2; 7 -4.293,-2; 8 -4.293,-2.8; 17 4.293,-2.8; 18 4.293,-2; 19 4.293,-1.2; 20 4.293,-0.4; 21 4.293,0.4; 22 4.293,1.2; 23 4.293,2; 24 4.293,2.8 | smd 0.559 x 1.27: 9 -2.8,-4.293; 10 -2,-4.293; 11 -1.2,-4.293; 12 -0.4,-4.293; 13 0.4,-4.293; 14 1.2,-4.293; 15 2,-4.293; 16 2.8,-4.293; 25 2.8,4.293; 26 2,4.293; 27 1.2,4.293; 28 0.4,4.293; 29 -0.4,4.293; 30 -1.2,4.293; 31 -2,4.293; 32 -2.8,4.293
3034 = smd 1.27 x 5.08: 1 10.985,0; 2 -10.985,0 | smd 3.96 x 3.96: 3 0,0
ABS2532768KHZT = smd 1.3 x 1.9: 1 -2.75,-1.05; 2 2.75,-1.05; 3 2.75,2.15; 4 -2.75,2.15

### Placement (x,y rotation side)
10K  14.88,26.91 270 bottom
C1  8.45,31.21 0 bottom
EIGHT(E)  2.84,10.38 0 top
EIGHT(G)  8.84,10.38 0 top
EIGHT(H)  11.84,10.38 0 top
EIGHT(I)  5.84,10.38 0 top
EIGHT(T)  14.84,10.38 0 top
EIGHT_EXTRA  1.81,9.45 90 bottom
ELEVEN(E2)  23.84,10.38 0 top
ELEVEN(E3)  29.84,10.38 0 top
ELEVEN(E)  17.88,10.38 0 top
ELEVEN(L)  20.84,10.38 0 top
ELEVEN(N)  32.84,10.38 0 top
ELEVEN(V)  26.84,10.38 0 top
FIVE(E)  23.84,13.38 0 top
FIVE(F)  14.84,13.38 0 top
FIVE(I)  17.88,13.38 0 top
FIVE(V)  20.84,13.38 0 top
FIVE_MIN_E  29.84,28.38 0 top
FIVE_MIN_F  20.84,28.38 0 top
FIVE_MIN_I  23.84,28.38 0 top
FIVE_MIN_V  26.84,28.38 0 top
FOUR(F)  2.84,13.38 0 top
FOUR(O)  5.84,13.38 0 top
FOUR(R)  11.84,13.38 0 top
FOUR(U)  8.84,13.38 0 top
HALF(A)  23.84,31.38 0 top
HALF(F)  29.84,31.38 0 top
HALF(H)  20.84,31.38 0 top
HALF(L)  26.84,31.38 0 top
IC1  8.55,12.51 0 bottom
IC2  4.05,19.63 0 bottom
IC3  21.25,29.86 90 bottom
IS_I  11.84,31.38 0 top
IS_S  14.84,31.38 0 top
IT_I  2.84,31.38 0 top
IT_T  5.84,31.38 0 top
NINE(E)  29.84,7.38 0 top
NINE(I)  23.84,7.38 0 top
NINE(N2)  26.84,7.38 0 top
NINE(N)  20.84,7.38 0 top
NINE_EXTRA1  2.92,5.43 180 bottom
NINE_EXTRA2  17.88,7.38 180 top
OCLOCK_C1  20.84,4.38 0 top
OCLOCK_C2  29.84,4.38 0 top
OCLOCK_K  32.84,4.38 0 top
OCLOCK_L  23.84,4.38 0 top
OCLOCK_O1  17.84,4.38 0 top
OCLOCK_O2  26.84,4.38 0 top
ONE(E)  8.84,16.38 0 top
ONE(N)  5.84,16.38 0 top
ONE(O)  2.84,16.38 0 top
ONE_EXTRA  5.97,4.88 0 bottom
PAST_A  5.84,19.38 0 top
PAST_EXTRA1  13.66,29.7 180 bottom
PAST_EXTRA2  13.68,30.4 180 bottom
PAST_P  2.84,19.38 0 top
PAST_S  8.84,19.38 0 top
PAST_T  11.84,19.38 0 top
QUARTER_A  8.84,25.38 0 top
QUARTER_E  17.84,25.38 0 top
QUARTER_EXTRA  23.51,25.41 0 top
QUARTER_Q  2.84,25.38 0 top
QUARTER_R1  11.84,25.38 0 top
QUARTER_R2  20.84,25.38 0 top
QUARTER_T  14.84,25.38 0 top
QUARTER_U  5.84,25.38 0 top
RED1  7.04,16.34 0 bottom
RED2  11.57,18.39 180 bottom
RED5  22.55,25.18 0 bottom
RED7  15.7,26.94 270 bottom
SEVEN(E2)  11.84,7.38 0 top
SEVEN(E)  5.84,7.38 0 top
SEVEN(N)  14.84,7.38 0 top
SEVEN(S)  2.84,7.38 0 top
SEVEN(V)  8.84,7.38 0 top
SEVEN_EXTRA  11.83,5.08 0 bottom
SIX(I)  14.84,16.38 0 top
SIX(S)  11.84,16.38 0 top
SIX(X)  17.84,16.38 0 top
SIX_EXTRA  5.98,5.67 180 bottom
TEN(E)  8.84,4.33 0 top
TEN(N)  11.84,4.33 0 top
TEN(T)  5.84,4.31 0 top
TEN_EXTRA  4.02,3.75 180 bottom
TEN_MIN_E  29.84,25.38 0 top
TEN_MIN_EXTRA  32.84,7.38 180 top
TEN_MIN_N  32.84,25.38 0 top
TEN_MIN_T  26.84,25.38 0 top
THREE(E2)  32.84,16.38 0 top
THREE(E)  29.84,16.38 0 top
THREE(H)  23.75,16.39 0 top
THREE(R)  26.84,16.38 0 top
THREE(T)  20.84,16.38 0 top
THREE_EXTRA  1.72,14.29 270 bottom
TO_O  29.84,22.38 0 top
TO_T  26.84,22.38 0 top
TWELVE(E2)  32.84,19.38 0 top
TWELVE(E)  23.84,19.38 0 top
TWELVE(L)  26.84,19.38 0 top
TWELVE(T)  17.84,19.38 0 top
TWELVE(V)  29.84,19.38 0 top
TWELVE(W)  20.84,19.38 0 top
TWENTY_MIN_E  8.84,28.36 0 top
TWENTY_MIN_N  11.84,28.38 0 top
TWENTY_MIN_T1  2.84,28.36 0 top
TWENTY_MIN_T2  14.84,28.38 0 top
TWENTY_MIN_W  5.84,28.38 0 top
TWENTY_MIN_Y  17.84,28.38 0 top
TWO(O)  32.84,13.38 0 top
TWO(T)  26.84,13.38 0 top
TWO(W)  29.84,13.38 0 top
TWO_EXTRA  1.75,12.35 90 bottom
U1  8.45,25.5 90 bottom
U2  25.8,12.65 270 bottom
Y1  28.53,29.15 180 bottom

### Tracks (layer width: path | path; a pad name or v marks a point on that pad's centre or on a via)
BUTTON  (via drill 0.7)
  Bottom 0.305: U1.1 U1.2 10.45,18.92 10.34,18.81 10.34,18.56 9.09,17.31 7.42,17.31 | RED1.1 7.59,17.14 7.42,17.31 | 7.42,17.31 7.37,17.36 2,17.36 1.17,18.19 1.17,27.92 1.71,28.47 1.71,28.98 v2.52,29.79
EX_CLCK1
  Bottom 0.305: Y1.4 25.64,27.14 IC3.1
EX_CLCK2
  Bottom 0.305: Y1.1 25.78,29.97 21.88,29.97 IC3.2
GND  (via drill 0.35, 0.7)  (1 unrouted)
  Top 0.305: v18.9,12.02 18.89,12.02 15.28,12.02 v15.28,12.1 | v31.82,21.21 v29.79,21.21 | v7.26,28.1 7.73,28.57 7.73,28.74 8.61,29.62 17.81,29.62 v18.19,29.99
  Top 0.406: v22.49,15.06 v18.94,15.06
  Bottom 0.152: 17.01,16.19 17.22,16.19 17.22,18.36 17.46,18.36 17.46,19.12 16.82,19.12 16.82,20.31 16.18,20.31 16.18,25.42 16.87,25.42 16.87,25.53 18.55,25.53 18.55,27.12
  Bottom 0.2: IC3.4 18.19,28.29 v18.19,29.99 | 7.86,28.36 7.53,28.36 v7.26,28.1 | 4.05,17.82 2.28,17.82
  Bottom 0.254: U1.21 8.85,29.28 8.72,29.28 8.72,28.36 7.86,28.36 7.26,28.36 7.26,22.63
  Bottom 0.305: U1.5 8.05,20.03 8.89,20.03 | 8.89,20.03 9.66,20.03 9.66,20.02 9.65,20.02 U1.3 9.47,21.39 9.47,22.63 7.26,22.63 | IC2.2 4.05,17.82 8.89,17.82 8.89,20.03 | IC1.9 12.1,10.36 13.3,10.36 13.3,11.92 13.31,11.92 13.31,12.59 | 13.31,12.59 13.31,14.14 IC1.3 IC1.4 IC1.5 | IC3.4 18.62,27.14 | C1.1 8.9,29.8 U1.21 | v18.9,12.02 18.94,12.02 v18.94,15.06 17.01,15.06 17.01,16.19 | v15.28,12.1 15.02,12.36 15.02,12.59 13.31,12.59 | v31.82,21.21 31.82,22.87 v33.4,22.87 | v29.79,21.21 25.8,21.21 25.8,15.15 U2.3 | v2.33,22.29 2.28,22.24 2.28,17.82
  Bottom 0.406: 25.8,15.15 22.49,15.15 v22.49,15.06
HOUR1  (via drill 0.35)
  Top 0.152: 8.38,17.31 8.39,17.29 ONE(E).1 | ONE(N).2 6.29,17.36 | 2.39,14.02 FOUR(F).1 | 12.29,14.02 FOUR(R).2 | 8.28,14.02 8.39,13.91 FOUR(U).1 8.39,14.02 8.49,14.02 | SEVEN(S).2 3.29,8.01 | SEVEN(V).1 8.48,7.46 8.48,7.85 8.31,8.01 8.18,8.01 | SEVEN(E).1 5.39,7.93 5.48,8.01 | 6.36,5.22 6.29,5.14 TEN(T).2 | TEN(E).2 9.29,5.13 9.38,5.22 | EIGHT(G).1 8.39,11.01 8.45,11.01 | 12.26,11 12.26,10.38 EIGHT(H).2 | 3.29,17.38 3.29,17.31 ONE(O).2 | v10.37,4.38 10.37,5.22 10.37,5.24 | v4.56,5.09 4.54,5.11 4.54,5.22 | 6.34,14.02 6.29,14.02 FOUR(O).2 | v8.99,14.82 9.09,14.82 9.09,14.02
  Top 0.203: TEN(N).1 11.38,5.22 11.36,5.22
  Top 0.305: 6.29,17.31 8.38,17.31 | 6.34,14.02 8.28,14.02 12.29,14.02 | EIGHT(E).2 4.08,10.37 4.08,10.39 | 8.18,8.01 5.48,8.01 3.29,8.01 3.23,8.01 3.23,9.27 1.7,9.27 | 10.37,5.22 9.38,5.22 6.36,5.22 4.54,5.22 1.89,5.22 1.7,5.41 1.7,9.27 | 11.36,5.22 11.33,5.24 10.37,5.24 | 12.26,11.01 8.45,11.01 4.08,11.01 4.08,10.39 | 12.26,11.01 12.26,11 | 3.29,17.31 6.29,17.31 | 6.29,17.31 6.29,17.36 | 12.26,11.01 12.26,14.02 9.09,14.02 8.49,14.02 3.54,14.02 v3.54,14.24 2.39,14.24 FOUR(F).1 | 2.39,14.02 1.7,14.02 | 1.7,14.02 1.7,9.27 | 1.7,14.02 1.7,17.38 3.29,17.38 | EIGHT(I).1 5.39,10.39 4.08,10.39
  Bottom 0.152: 6.52,4.78 6.71,4.6 6.71,2.55 3.57,2.55 TEN_EXTRA.1 3.89,4.07 3.89,4.1 4.56,4.76 v4.56,5.09 | SEVEN_EXTRA.2 10.37,5.08 v10.37,4.38 | IC1.19 5,14.82 v8.99,14.82
  Bottom 0.305: ONE_EXTRA.1 6.52,4.78 | IC1.19 4.06,14.79 4.06,14.66 3.79,14.66 3.79,14.24 v3.54,14.24
HOUR2  (via drill 0.35)
  Top 0.152: TWELVE(T).1 17.56,19.55 17.56,20.06 | 27.33,20.06 27.33,19.42 TWELVE(L).2 | TWELVE(E).2 24.29,20.05 24.27,20.06 | TWELVE(W).1 20.39,19.94 20.27,20.06 | SIX(S).1 11.39,16.61 11.73,16.94 | SIX(X).2 18.29,16.94 17.22,16.94 17.22,17.08 v15.95,17.08 | FIVE(F).1 14.39,14.11 14.43,14.14 | FIVE(E).2 24.29,13.93 24.08,14.14 | FIVE(V).1 20.39,14.09 20.45,14.14 | FIVE(I).2 18.33,14.12 18.31,14.14 | EIGHT(T).1 14.39,11.18 14.41,11.2 | 21.18,11.17 21.29,11.06 ELEVEN(L).2 | ELEVEN(E).2 18.33,11.05 18.49,11.2 | NINE(N2).2 27.29,8.17 27.13,8.33 26.94,8.52 | NINE(I).2 24.29,8.24 24.2,8.33 | NINE(N).2 21.29,8.29 21.24,8.33 | SEVEN(N).1 14.39,8.14 | NINE_EXTRA2.1 18.33,8.33 18.49,8.33 | SEVEN(E2).1 11.39,7.86 11.68,8.15
  Top 0.203: SIX(I).1 14.39,16.91 | 12.23,16.99 12.23,16.91 14.39,16.91 | 20.45,14.14 24.08,14.14 | 17.56,20.06 20.27,20.06 | 14.39,16.91 14.39,16.99 15.87,16.99 v15.95,17.08
  Top 0.305: 20.27,20.06 24.27,20.06 27.33,20.06 | 12.23,16.99 v11.95,17.27 11.95,17.16 11.73,16.94 | 15.95,14.14 18.31,14.14 20.45,14.14 | 15.95,14.14 14.6,14.14 | 14.43,14.14 14.6,14.14 | 16.28,11.2 14.41,11.2 13.74,11.2 13.52,11.42 13.52,14.09 13.56,14.13 14.58,14.13 14.6,14.14 | 16.28,11.2 18.49,11.2 21.15,11.2 21.18,11.17 | v16.1,8.33 15.91,8.15 11.68,8.15 | v16.1,8.33 15.9,8.14 14.39,8.14 | v16.1,8.33 18.49,8.33 21.24,8.33 24.2,8.33 27.13,8.33 | 26.94,8.52 29.92,8.52 30.07,8.38 30.29,8.38 NINE(E).2 30.05,7.38 30.05,6.24 13.27,6.24 13.27,2.69 5,2.69 3.36,4.34 v2.48,4.34 | v15.95,14.85 15.95,14.14 | 16.28,11.2 16.28,10.44 v16.21,10.45 | 17.56,20.06 16.8,20.06 16.74,20 16.74,17.25 15.95,17.25 v15.95,17.08
  Bottom 0.152: EIGHT_EXTRA.1 1.81,8.87 1.73,8.87 1.73,7.46 1.81,7.46 1.81,4.24 2.48,4.24 v2.48,4.34 | v2.48,4.34 v2.47,4.34 NINE_EXTRA1.1 | SIX_EXTRA.2 6.11,5.67 6.11,6.61 3.95,6.61 3.95,4.95 2.48,4.95 v2.48,4.34
  Bottom 0.305: IC1.18 10.4,14.14 10.4,16.57 12.34,16.57 12.34,17.27 v11.95,17.27 | v15.95,14.85 v15.95,17.08 | v16.1,8.33 16.14,8.38 16.14,10.39 v16.21,10.45
HOUR3  (via drill 0.35)
  Top 0.152: TWELVE(V).1 29.39,20.03 | 29.39,20.03 | 32.39,20.03 TWELVE(E2).1 | 33.14,17.08 33.07,17.15 | TWO(T).1 26.37,13.4 26.37,14.18 26.41,14.22 | 32.4,14.12 TWO(O).1 | TWO(W).2 30.29,14.06 30.45,14.22 | ELEVEN(E2).1 23.39,11.02 23.53,11.17 | 33.19,11.26 33.25,11.2 33.29,11.16 ELEVEN(N).2 | ELEVEN(E3).2 30.29,11.18 30.21,11.26 | ELEVEN(V).1 26.39,11.21 26.34,11.26 | 23.81,17 23.3,16.48 THREE(H).1 | THREE(T).2 21.29,17 | 33.58,11.2 33.58,12.49 33.87,12.79 33.87,13.72 33.5,14.09 v33.5,14.69 | THREE(R).1 26.39,17 26.31,17 | 30.28,17 THREE(E).2 | 32.39,20.03 32.39,20.14 32.83,20.14 32.83,20.85 33.58,20.85 v33.58,20.24
  Top 0.2: 33.14,15.67 33.16,15.67
  Top 0.305: 29.39,20.03 32.39,20.03 | 23.81,17 24.3,17 | 33.07,17.15 32.91,17 30.73,17 30.28,17 26.31,17 24.3,17 | 26.41,14.22 30.45,14.22 32.3,14.22 | 32.3,14.22 32.4,14.12 | 23.53,11.17 23.63,11.26 26.34,11.26 30.21,11.26 33.19,11.26 | 32.3,14.22 33.16,15.08 | 33.16,15.08 33.16,15.67 | 33.14,15.67 33.14,15.82 | 33.14,15.82 33.14,17.08 | v33.58,8.37 33.58,11.2 33.25,11.2 | THREE(E2).2 33.29,15.97 33.14,15.82 | 33.16,15.08 33.5,15.08 v33.5,14.69 | 24.3,17 21.29,17
  Bottom 0.152: 4.91,12.3 3.87,12.3 3.87,12.53 1.98,12.53 | THREE_EXTRA.2 1.98,13.84 1.98,12.53 | TWO_EXTRA.2 1.75,12.53 1.98,12.53
  Bottom 0.2: 4.91,12.3 4.91,12.27 IC1.15
  Bottom 0.305: v33.58,8.37 33.58,3.54 31.66,1.63 28.64,1.63 28.64,2.6 22.95,2.6 22.95,1.7 15.85,1.7 15.85,2.69 14.43,2.69 14.43,2.19 9.16,2.19 9.16,11.14 8.56,11.14 8.56,12.29 5,12.29 IC1.15 | v33.5,14.69 33.5,20.16 v33.58,20.24
HOUR4  (via drill 0.35)
  Top 0.152: TWELVE(T).2 18.29,18.78 18.3,18.77 | TWELVE(E).1 23.39,18.71 | TWELVE(L).1 26.39,18.76 26.44,18.71 26.45,18.7 | TWELVE(V).2 30.29,18.7 | 20.39,18.4 THREE(T).1 | 20.36,18.74 20.39,18.71 | 33.15,18.65 33.29,18.65 TWELVE(E2).2 | TWELVE(W).2 21.32,19.35 21.32,18.74 | 32.43,20.52 32.52,20.52 32.52,22.01 33.57,22.01 v33.57,21.8
  Top 0.2: 20.39,18.71 20.39,18.4
  Top 0.305: 18.3,18.77 18.28,18.74 20.36,18.74 21.32,18.74 23.36,18.74 23.39,18.71 26.44,18.71 | 26.45,18.7 28.66,18.7 | 28.66,18.7 30.29,18.7 33.15,18.7 33.15,18.65 | 28.66,18.7 28.66,20.52 32.43,20.52 | TEN(T).1 5.42,4.31 5.42,3.76 5.97,3.76 | 8.39,3.76 6.03,3.76 5.97,3.76 | 8.39,3.76 TEN(E).1 | 8.39,3.76 9.58,3.76 9.58,3.6 10.37,3.6 | 10.37,3.6 12.29,3.6 TEN(N).2 | 10.37,3.6 10.37,3.48 v10.27,3.48 | v5.97,3.53 5.97,3.76
  Bottom 0.152: THREE_EXTRA.1 2.28,14.74 2.28,12.84 IC1.16 | v33.57,21.8 33.57,21.3 32.77,21.3 32.77,20.76
  Bottom 0.305: 32.77,20.76 32.77,3.47 31.4,2.1 29.1,2.1 29.1,3.06 22.49,3.06 22.49,2.15 16.31,2.15 16.31,3.15 13.98,3.15 13.98,2.73 9.64,2.73 9.64,3.46 | IC1.16 7.48,12.84 7.48,12.82 9.02,12.82 9.02,11.6 9.61,11.6 9.61,11.34 9.64,11.34 9.64,3.46 | v10.27,3.48 10.27,3.46 9.64,3.46 | TEN_EXTRA.2 5.97,3.75 v5.97,3.53
HOUR5  (via drill 0.35)
  Top 0.152: ONE(O).1 2.39,15.68 | THREE(E2).1 32.61,16.16 32.61,15.74 | THREE(E).1 29.39,15.74 | THREE(R).2 27.29,15.75 | SIX(S).2 12.29,15.69 12.23,15.62 12.11,15.5 | ONE(E).2 9.29,15.52 | 9.29,15.52 9.3,15.53 | 9.29,15.52 9.27,15.5 | THREE(H).2 24.2,15.9 | v4.56,6 4.56,6.18 10.53,6.18 v10.53,6.09 | 15.15,15.62 15.29,15.76 SIX(I).2 | SIX(X).1 17.39,15.65 17.37,15.62 | ONE(N).1 5.39,15.53 5.38,15.53
  Top 0.203: 2.39,15.68 2.39,15.1 2.44,15.1
  Top 0.305: 9.27,15.5 12.11,15.5 | 12.23,15.62 15.15,15.62 17.37,15.62 18.54,15.62 18.66,15.75 24.04,15.75 | 27.09,15.75 24.69,15.75 24.04,15.75 | 27.09,15.75 27.29,15.75 | 29.39,15.74 29.58,15.74 | 29.58,15.74 32.61,15.74 | v2.98,15.09 5.13,15.09 5.13,15.53 5.38,15.53 9.3,15.53 | 24.04,15.75 24.2,15.9 | 27.09,15.75 27.1,15.76 29.55,15.76 29.58,15.74 | v2.98,15.09 2.44,15.09 2.44,15.1 v2.98,15.1 v2.98,15.09
  Bottom 0.152: ONE_EXTRA.2 SIX_EXTRA.1 4.89,5.67 v4.56,6 | IC1.17 5,13.5 5.22,13.5 7.86,13.5 7.86,13.2 9.4,13.2 9.4,11.98 10,11.98 10,11.72 10.03,11.72 10.03,8.67 10.65,8.67 10.65,6.09 v10.53,6.09 | 2.83,13.53 2.83,14.95 2.98,14.95 v2.98,15.09
  Bottom 0.203: 5.22,13.5 5.22,13.56 3.39,13.56 3.39,13.53 2.83,13.53
  Bottom 0.305: IC1.17 4.93,13.56 3.39,13.56
HOUR6  (via drill 0.35)
  Top 0.152: FIVE(I).1 17.52,13.29 17.52,12.81 | 21.36,12.73 21.32,12.77 21.29,12.8 FIVE(V).2 | 33.26,12.71 33.29,12.75 TWO(O).2 | TWO(W).1 29.49,13.28 29.49,12.73 | TWO(T).2 27.29,12.86 27.17,12.73 | FIVE(E).1 23.39,12.75 23.4,12.73 | 11.43,12.63 11.43,13.34 FOUR(R).1 | 9.27,12.7 9.27,13.36 FOUR(U).2 | 5.35,12.7 5.39,12.74 FOUR(O).1 | FOUR(F).2 3.36,13.38 3.36,12.7
  Top 0.203: 14.17,12.79 14.17,12.85 15.25,12.85 | 15.29,12.85 15.29,12.81 17.52,12.81 17.52,12.76 18.61,12.76 18.61,12.77 18.97,12.77
  Top 0.305: 21.32,12.77 18.97,12.77 | 33.26,12.71 33.23,12.73 29.49,12.73 27.17,12.73 23.4,12.73 21.36,12.73 | 11.43,12.63 10.38,12.63 v10.11,12.69 9.27,12.7 5.35,12.7 3.36,12.7 3.39,12.67 v3.39,11.9 | FIVE(F).2 15.29,12.85 15.25,12.85 | 14.17,12.79 14.17,11.91 v14.2,11.88
  Bottom 0.152: TWO_EXTRA.1 2.06,12.21 3.2,12.21 3.2,11.51 | v3.39,11.9 3.42,11.9 3.42,11.51
  Bottom 0.305: v10.11,12.69 10.41,12.39 10.41,9.06 13.77,9.06 13.77,11.45 v14.2,11.88 | IC1.14 5,11.51 3.42,11.51 3.2,11.51
HOUR7  (via drill 0.35)
  Top 0.152: ELEVEN(N).1 32.39,9.62 32.23,9.46 | EIGHT(E).1 2.39,9.73 | EIGHT(T).2 15.29,9.78 15.25,9.74 | ELEVEN(E).1 17.43,9.53 | 17.43,9.53 17.66,9.3 | 17.23,9.74 17.43,9.53 | ELEVEN(L).1 20.39,9.51 20.6,9.3 | ELEVEN(E2).2 24.29,9.31 24.29,9.3 | ELEVEN(V).2 27.29,9.64 27.63,9.3 | ELEVEN(E3).1 29.39,9.47 29.56,9.3 | EIGHT(I).2 6.33,10.34 6.33,9.73 | EIGHT(G).2 9.29,9.84 9.18,9.73 | EIGHT(H).1 11.39,9.8 11.46,9.73
  Top 0.305: 32.23,9.46 32.07,9.3 29.56,9.3 27.63,9.3 24.29,9.3 20.6,9.3 17.66,9.3 | 17.23,9.74 15.25,9.74 15.24,9.73 11.46,9.73 9.18,9.73 6.33,9.73 2.39,9.73 2.39,11.14 2.52,11.27 v2.52,11.29
  Bottom 0.152: v2.52,11.29 2.52,10.73 2.06,10.73 2.06,9.9 EIGHT_EXTRA.2
  Bottom 0.305: IC1.13 2.52,10.89 v2.52,11.29
HOUR8  (via drill 0.35)
  Top 0.152: SEVEN(S).1 2.39,6.62 2.44,6.57 | NINE(E).1 29.39,6.81 | SEVEN(E).2 6.29,6.81 6.11,6.81 | SEVEN(V).2 9.29,6.81 9.28,6.81 | SEVEN(E2).2 12.29,6.81 12.44,6.81 | SEVEN(N).2 15.29,6.81 15.33,6.81 | NINE_EXTRA2.2 17.43,6.81 17.39,6.81 | v13.4,7.02 13.4,6.81 13.51,6.81 | NINE(I).1 23.39,6.83 23.37,6.81 | NINE(N2).1 26.39,6.86 26.45,6.81 | NINE(N).1 20.43,7.33 20.43,6.81
  Top 0.305: 29.39,6.81 26.45,6.81 23.37,6.81 20.43,6.81 17.39,6.81 15.33,6.81 13.51,6.81 12.44,6.81 9.28,6.81 6.11,6.81 2.68,6.81 2.44,6.57 | v2.44,8.17 2.39,8.17 2.39,6.62
  Bottom 0.152: NINE_EXTRA1.2 3.05,5.43 3.05,5.91 2.44,5.91 v2.44,8.17 | SEVEN_EXTRA.1 12.28,7.02 v13.4,7.02
  Bottom 0.305: IC1.12 4.96,10.2 2.44,10.2 v2.44,8.17
INDICATOR1  (via drill 0.35 pad 0.55)
  Top 0.152: TO_T.2 27.29,22.8 27.52,23.03 | 30.02,22.96 30.29,22.68 TO_O.2 | OCLOCK_O1.2 18.29,4.74 18.6,5.05 | 26.16,5.08 26.39,4.85 OCLOCK_O2.1 | OCLOCK_L.1 23.39,5.06 23.37,5.08 | OCLOCK_C1.2 21.29,4.85 21.52,5.08 | PAST_P.1 2.39,19.92 2.48,20.01 | 5.5,20.01 5.5,19.48 PAST_A.1 | v8.77,23.34 9.19,23.34 9.37,23.16 9.56,22.97
  Top 0.305: 30.02,22.96 29.95,23.03 27.52,23.03 25.61,23.03 25.61,20.99 12.85,20.99 12.85,21.48 11.16,23.16 9.37,23.16 | 18.6,5.05 18.63,5.08 21.52,5.08 22.78,5.08 | 22.78,5.08 23.37,5.08 26.16,5.08 | 2.48,20.01 5.5,20.01 6.19,20.01 6.19,20.47 9.42,20.47 9.42,21.38 9.56,21.38 9.56,22.97 | 22.78,5.08 22.78,5.74 13.73,5.74 13.73,2.14 3.63,2.14 1.17,4.59 1.17,8.65 1.24,8.65 1.24,21.38 5.79,21.38 5.79,23.32 6.72,23.32 6.72,23.34 v8.77,23.34
  Bottom 0.152: 8.05,23.34 v8.77,23.34
  Bottom 0.254: 10.45,28.85 10.45,28.82 9.18,28.82 9.18,28.62 9.13,28.62 9.13,27.95 7.97,27.95 7.97,23.34 8.05,23.34
  Bottom 0.305: U1.23 10.45,28.85
INDICATOR2  (via drill 0.35, 0.35 pad 0.55)
  Top 0.152: OCLOCK_O1.1 17.41,4.35 17.41,4.05 17.6,3.87 | 27.17,3.82 27.31,3.96 27.31,4.35 OCLOCK_O2.2 | OCLOCK_L.2 24.31,4.35 24.31,3.86 24.35,3.82 | OCLOCK_C1.1 20.41,4.35 20.41,3.95 20.28,3.82 | 9.29,20.01 PAST_S.2 | PAST_T.2 12.29,19.85 12.13,20.01 11.02,20.01 | v13.21,19.69 13.21,19.38
  Top 0.305: 17.6,3.87 17.65,3.82 20.28,3.82 24.35,3.82 27.17,3.82 | v10.26,22.41 10.6,22.41 11.02,21.99 11.02,20.01 9.29,20.01 | 13.21,19.38 PAST_T.2 | v14.47,19.46 14.47,17.66 v15,17.66 | v15.38,9.02 15.31,8.95 15.31,8.75 v4.64,8.75 | v15.14,1.98 14.24,1.98 14.24,5.29 17.39,5.29 OCLOCK_O1.1
  Bottom 0.152: 13.5,19.76 13.27,19.76 v13.21,19.69
  Bottom 0.2: v15,17.66 14.51,17.66
  Bottom 0.203: v4.64,8.75 4.64,8.42
  Bottom 0.254: 9.61,28.39 9.59,28.39 9.59,27.55 8.69,27.55 8.69,24.89 10.91,24.89 10.91,22.43 10.36,22.43
  Bottom 0.305: 9.61,28.39 11.25,28.39 U1.24 11.25,30.41 12.51,30.41 12.51,29.7 PAST_EXTRA1.1 13.23,29.7 PAST_EXTRA2.1 | 10.36,22.43 10.29,22.43 v10.26,22.41 | v14.47,19.46 14.47,19.76 13.5,19.76 | 14.51,17.66 14.51,13.05 16.16,13.05 16.16,11.28 15.39,11.28 15.39,9.03 v15.38,9.02 | 4.64,8.42 8.25,8.42 8.25,1.73 14.89,1.73 v15.14,1.98
INDICATOR3  (via drill 0.35 pad 0.55)
  Top 0.152: TO_T.1 26.62,22.14 26.62,21.75 | 29.36,21.75 29.39,21.78 TO_O.1 | PAST_P.2 3.4,19.27 3.4,18.65 | 11.42,18.65 11.42,19.35 PAST_T.1 | 8.28,18.65 8.39,18.77 PAST_S.1 | 6.23,18.65 6.29,18.71 PAST_A.2 | 13.85,20.48 13.85,18.65
  Top 0.305: 29.36,21.75 28.04,21.75 | 28.04,21.75 26.62,21.75 | 3.4,18.65 6.23,18.65 8.28,18.65 11.42,18.65 13.85,18.65 | 13.07,20.48 13.85,20.48 | 13.07,20.48 13.07,20.53 28.04,20.53 28.04,21.75 | 13.07,20.48 12.18,20.48 v12.18,20.69
  Bottom 0.254: 10.1,27.93 9.99,27.93 9.99,27.14 9.09,27.14 9.09,25.32 11.35,25.32 11.35,22.13 11.84,22.13 11.84,21.05
  Bottom 0.305: 10.1,27.93 11.71,27.93 11.71,28.09 12.74,28.09 U1.25 13.35,28.3 13.35,29.12 14.11,29.12 PAST_EXTRA1.2 14.13,29.7 PAST_EXTRA2.2 | v12.18,20.69 11.84,20.69 11.84,21.05
IT_IS1  (via drill 0.35)
  Top 0.152: 14.32,30.42 14.39,30.49 IS_S.1 | 11.3,30.42 11.3,31.29 IS_I.1 | 6.44,30.42 6.29,30.58 | 6.29,30.58 6.08,30.79 | 6.29,30.58 IT_T.2 | IT_I.2 3.29,30.84 3.24,30.79
  Top 0.305: 3.79,30.79 6.08,30.79 | 6.44,30.42 11.3,30.42 14.32,30.42 | v1.89,24.6 1.66,24.6 1.66,30.79 3.24,30.79 3.79,30.79 | 3.79,30.79
  Bottom 0.305: U1.11 2.96,24.3 2.96,24.31 1.89,24.31 v1.89,24.6
IT_IS2  (via drill 0.35)
  Top 0.152: IS_I.2 12.29,31.94 | IT_I.1 2.39,31.91 2.35,31.94 | IT_T.1 5.35,31.42 5.35,31.94
  Top 0.305: v2.18,23.52 1.2,23.52 1.2,31.1 2.05,31.94 2.35,31.94 5.35,31.94 12.29,31.94 15.31,31.94 15.31,31.4 IS_S.2
  Bottom 0.305: v2.18,23.52 4.16,23.52 U1.10
MIN1  (via drill 0.35)
  Top 0.152: TWENTY_MIN_T1.1 2.39,28.87 2.39,28.93 | 5.39,28.93 TWENTY_MIN_W.1 | QUARTER_Q.1 2.39,26.09 2.44,26.14 | 12.08,26.04 12.29,25.83 QUARTER_R1.2 | QUARTER_U.2 6.29,26.08 6.24,26.14 | 9.23,26.04 9.39,26.19 v9.83,26.19 | QUARTER_A.1 8.39,26.2 | v16.83,24.28 16.74,24.19 6.8,24.19 6.8,23.77 6.38,23.77 | v19.43,25.74 19.7,26.01 21.29,26.01 | 21.29,26.01 22.17,26.01 | QUARTER_R2.2 21.29,26.01 | 21.29,26.01
  Top 0.203: QUARTER_EXTRA.2 23.96,26.01 22.17,26.01
  Top 0.305: 5.39,28.93 2.39,28.93 | v9.83,26.19 v9.82,26.2 8.39,26.2 8.33,26.14 6.24,26.14 2.44,26.14 2.39,26.14 2.39,28.87 | 9.23,26.04 12.08,26.04 | QUARTER_Q.1 2.58,25.19 2.58,24.1 4.93,24.1 4.93,23.86 5.61,23.86 5.7,23.77 6.38,23.77
  Bottom 0.152: v16.83,24.28 17.21,24.66 17.21,25.23 19,25.23 19,25.67 19.43,25.67 v19.43,25.74
  Bottom 0.305: v9.83,26.19 9.83,26.71 10.43,26.71 10.43,27.47 12.17,27.47 12.17,27.5 U1.26
MIN2  (via drill 0.35, 0.35 pad 0.55)
  Top 0.152: TWENTY_MIN_E.2 9.29,29.02 9.35,29.08 | 17.38,29.1 17.39,29.1 TWENTY_MIN_Y.1 | TWENTY_MIN_T2.1 14.39,29.01 14.48,29.1 | TWENTY_MIN_N.2 12.29,29.08 12.31,29.1 | QUARTER_T.2 15.37,25.46 15.37,25.99 | 18.4,26.68 17.97,26.25 17.97,25.7 QUARTER_E.2 18.29,25.48 16.66,27.17 v16.66,27.11 16.55,27.22 14.5,27.22 13.76,26.48 | TEN_MIN_T.1 26.39,25.98 26.38,25.99 25.69,26.68 | TEN_MIN_E.1 29.39,25.9 29.3,25.99
  Top 0.305: 9.35,29.08 9.37,29.1 12.31,29.1 14.48,29.1 16.5,29.1 | 16.5,29.1 17.38,29.1 | 15.37,25.99 15.45,25.99 | 26.38,25.99 29.3,25.99 | 13.76,26.48 12.54,26.48 12.54,26.49 11.11,26.49 v11.11,26.75 | 16.5,29.1 16.5,29 v16.43,28.93 | 18.4,26.68 18.84,26.68 18.84,27.03 21.11,27.03 21.11,26.68 25.69,26.68
  Top 0.406: 13.76,26.48 14.97,26.48 15.45,25.99
  Bottom 0.152: v16.43,28.93 16.43,27.29 v16.66,27.11
  Bottom 0.305: v11.11,26.75 11.79,26.07 11.79,24.3 U1.30
MIN3  (via drill 0.35)
  Top 0.152: HALF(H).2 21.29,32.07 21.41,32.19 | 29.25,32.14 29.39,32 HALF(F).1 | HALF(L).1 26.39,31.94 26.14,32.19 | HALF(A).2 24.29,32.07 24.4,32.19 | FIVE_MIN_F.2 21.29,28.94 21.44,29.09 | FIVE_MIN_V.1 26.39,29 26.48,29.09 | FIVE_MIN_I.2 24.29,29.02 24.36,29.09 | 31.02,28.9 31.02,28.98 | OCLOCK_C2.1 29.49,4.28 29.49,3.69 | 32.47,3.64 32.47,4.3 OCLOCK_K.1 | 29.39,29.09 FIVE_MIN_E.1 29.71,28.7 29.71,28.72 29.84,28.86 31.02,28.86 31.02,28.49 | v14.16,22.53 14.57,22.53 14.57,21.91 21.23,21.91 21.23,23.93 21.55,23.93 v21.56,23.92 | v29.64,24.21 33.28,24.21 33.29,24.22
  Top 0.2: OCLOCK_C2.1 29.39,4.87 30.89,6.37 30.89,7.32 30.95,7.38 TEN_MIN_EXTRA.2
  Top 0.254: 28.91,32.19 30.98,32.19 30.98,28.94 31.02,28.9
  Top 0.305: 21.41,32.19 24.4,32.19 26.14,32.19 28.91,32.19 29.2,32.19 29.25,32.14 | 21.44,29.09 24.36,29.09 26.48,29.09 29.39,29.09 30.91,29.09 31.02,28.98 | 31.02,28.49 31.02,26.02 31.04,26.04 33.29,26.04 TEN_MIN_N.2 33.29,24.22 | 31.02,28.49 31.02,28.9 | 29.49,3.69 29.54,3.64 32.47,3.64 | OCLOCK_C2.1 27.95,4.38 27.95,2.84 16.31,2.84 16.31,3.15 15.98,3.15 v15.98,4.6 | v31.66,28.54 31.66,28.49 31.02,28.49
  Bottom 0.152: U1.31 13.68,23.5 13.68,22.99 14.16,22.99 v14.16,22.53
  Bottom 0.305: v15.98,4.6 15.98,5.67 31.14,5.67 31.14,25.74 30.32,25.74 30.32,28.54 v31.66,28.54 | v21.56,23.92 21.75,23.92 21.88,23.79 21.88,22.21 29.12,22.21 29.12,24.21 v29.64,24.21
MIN4  (via drill 0.35)
  Top 0.152: HALF(H).1 20.39,30.96 20.58,30.77 | 30.06,30.68 30.29,30.91 HALF(F).2 | HALF(L).2 27.29,30.74 27.35,30.68 | HALF(A).1 23.39,30.78 23.29,30.68
  Top 0.254: 20.67,30.68 19.08,30.68 19.08,32.6 19.42,32.6
  Top 0.305: 20.58,30.77 20.67,30.68 23.29,30.68 27.35,30.68 30.06,30.68 | 19.42,32.6 20.95,32.6 20.95,32.64 28,32.64 v28,32.87 | v13.8,21.67 13.8,21.45 22.28,21.45 22.28,23.94 v22.55,23.94
  Bottom 0.305: v28,32.87 28,24.57 28.64,24.57 28.64,22.66 22.88,22.66 22.88,23.75 22.69,23.94 v22.55,23.94 | v13.8,21.67 12.74,21.67 U1.32
MIN5  (via drill 0.35)
  Top 0.152: TWENTY_MIN_T1.2 3.28,27.66 | 5.98,27.52 6.12,27.66 6.29,27.83 TWENTY_MIN_W.2 | TWENTY_MIN_E.1 8.44,28.31 8.44,27.66 8.44,27.25 | TWENTY_MIN_N.1 11.42,28.35 11.42,27.66 | 18.29,27.79 TWENTY_MIN_Y.2 18.52,28.61 v19.27,28.61 19.27,28.38 FIVE_MIN_F.1 20.39,27.66 | FIVE_MIN_I.1 23.36,28.35 23.36,27.72 23.39,27.72 23.45,27.66 | FIVE_MIN_V.2 27.29,27.91 27.54,27.66 | FIVE_MIN_E.2 30.29,27.73 30.36,27.66 | 20.4,25.01 20.4,24.9 23.06,24.9 QUARTER_EXTRA.1 23.38,25.41 23.38,24.92 24.54,24.92 24.54,25.45 v25.09,25.45 | v27.04,27.11 27.04,27.66
  Top 0.203: QUARTER_R2.1 20.39,25.01 20.4,25.01
  Top 0.254: TWENTY_MIN_T2.2 15.77,28.38 15.77,27.81 15.77,27.66 15.45,27.66
  Top 0.305: 3.28,27.66 6.12,27.66 6.29,27.66 6.7,27.25 8.44,27.25 | 5.98,27.52 5.77,27.52 v5.77,26.88 | 8.44,27.66 11.42,27.66 15.45,27.66 | 30.36,27.66 27.54,27.66 27.04,27.66 23.45,27.66 20.39,27.66 | 18.29,27.79 18.27,27.81 15.77,27.81
  Bottom 0.152: v25.09,25.45 25.09,25.82 26.65,25.82 26.65,27.11 v27.04,27.11
  Bottom 0.305: U1.12 4.16,25.14 5.82,25.14 5.82,26.83 v5.77,26.88
MIN6  (via drill 0.35)
  Top 0.152: QUARTER_Q.2 3.29,24.86 3.53,24.63 | QUARTER_U.1 5.39,24.71 5.5,24.6 | QUARTER_A.2 9.29,24.76 9.45,24.6 | QUARTER_R1.1 11.39,24.95 11.74,24.6 12.29,24.6 12.29,24.9 12.87,24.9 12.87,24.92 14.39,24.92 | QUARTER_T.1 14.39,24.92 | OCLOCK_C2.2 30.29,5.13 30.3,5.13 | 33.29,4.49 OCLOCK_K.2 | TEN_MIN_T.2 27.32,25.35 27.32,24.61 | 27.32,24.61 23.35,24.61 23.35,24.59 19.21,24.59 | 19.21,24.59 19.21,24.56 20.59,24.56 20.61,24.54 v20.61,23.92 | 19.21,24.59 18.04,24.59 18.04,24.9 17.39,24.9 | 27.32,24.61 27.77,24.61 | 27.77,24.86 30.4,24.86 31.88,24.86 TEN_MIN_N.1 | 14.39,24.92 14.71,24.92 14.71,24.9 17.39,24.9 | 17.39,24.9 QUARTER_E.1
  Top 0.2: TEN_MIN_EXTRA.1 OCLOCK_K.2
  Top 0.203: 27.77,24.86 27.77,24.61
  Top 0.254: TEN_MIN_E.2 30.4,25.38 30.4,24.86
  Top 0.305: 3.53,24.63 3.55,24.6 5.5,24.6 6.11,24.6 | 6.11,24.6 9.45,24.6 11.74,24.6 | 30.3,5.13 33.1,5.13 33.1,4.74 33.29,4.74 33.29,4.49 | v14.98,4.16 15.01,4.13 15.01,2.69 15.85,2.69 15.85,2.38 31.85,2.38 33.05,3.57 33.05,4.13 OCLOCK_K.2 | v5.98,24.46 v5.98,24.47 6.11,24.6
  Bottom 0.152: v20.61,23.92 20.61,24.59 18.41,24.59 18.41,16.54
  Bottom 0.2: 19.91,6.12 19.91,15.03 18.41,16.54
  Bottom 0.305: U1.9 5.47,22.71 5.47,23.95 v5.98,24.46 | v14.98,4.16 14.98,6.12 19.91,6.12
MISO  (via drill 0.7)
  Bottom 0.305: U1.16 4.16,31.75 5.22,32.81 v5.93,32.81
MOSI  (via drill 0.7)
  Bottom 0.305: U1.15 3.94,27.72 3.4,27.72 3.22,27.9 3.22,28.71 3.7,29.19 3.7,31.94 3.81,32.05 3.81,32.4 v3.41,32.8
N$1
  Bottom 0.305: RED2.2 12.12,18.13 12.8,17.46 12.8,16.38 12.38,15.96 11.07,15.96 10.89,15.79 10.89,13.72 10.89,13.45 10.89,12.48 11.07,12.31 11.98,12.31 IC1.6
N$42
  Bottom 0.305: U1.20 8.05,31.21 C1.2
RESET  (via drill 0.35, 0.7)
  Top 0.152: v14.44,23.56 14.46,23.54 17.49,23.54 17.49,24.04 v17.79,24.04
  Top 0.254: v17.79,24.04 17.79,23.93 v19.55,23.93
  Bottom 0.152: 30.09,32.26 30.15,32.2 | v17.79,24.04 17.79,24.91 21.73,24.91 RED5.2
  Bottom 0.2: 19.66,17.88 19.68,17.88 21.86,15.7 21.86,12.27 23.71,10.42 27.88,10.42 30.42,12.95 30.42,24.74 29.21,25.95 29.21,31.38 30.09,32.26
  Bottom 0.254: 19.66,17.88 18.76,17.88 18.76,23.92 19.55,23.92 v19.55,23.93
  Bottom 0.305: U1.29 12.8,25.04 14.55,25.04 14.55,23.6 14.54,23.6 14.54,23.27 v14.44,23.56 | 30.15,32.2 31.38,32.2 v31.76,32.59
SCK  (via drill 0.7)
  Bottom 0.305: U1.17 5.65,30.91 7.54,32.8 v12.04,32.8
SCL_TO_SLAVE
  Bottom 0.152: 18.16,25.95 18.09,25.87 16.63,25.87 16.63,25.74 15.87,25.74 15.87,19.98 16.49,19.98 16.49,18.71 15.15,18.71 15.15,18.74
  Bottom 0.305: IC3.6 20.61,30.82 17.5,30.82 17.5,29.47 17.73,29.25 17.78,29.25 17.78,28.12 18.33,27.57 18.33,27.49 18.16,27.32 18.16,25.95 | IC1.1 13.55,15.44 13.55,18.74 15.15,18.74 15.15,25.45 14.88,25.45 10K.2
SDA_FROM_UC
  Bottom 0.305: U1.27 13.81,26.7 13.81,28.66 15.6,28.66 15.6,27.59 RED7.1
SDA_TO_SLAVE  (via drill 0.35)
  Top 0.152: 16.18,19.03 16.18,19.05 v15.88,19.35
  Top 0.305: 16.18,19.03 16.18,18.15 v16.02,17.99
  Bottom 0.152: 15.89,18.12 15.64,18.12 15.64,18.29 14.04,18.29 14.04,18.12 | 17.7,27.51 17.7,26.37 17.78,26.3 17.78,26.18 16.3,26.18 | RED7.2 15.56,26.25 15.56,25.33 15.54,25.33 15.54,19.7 15.56,19.7 15.56,19.67
  Bottom 0.2: 15.56,19.67 v15.88,19.35
  Bottom 0.203: 16.3,26.18 16.3,26.39 RED7.2
  Bottom 0.305: IC3.5 19.34,31.39 19.32,31.37 17.21,31.37 17.21,31.17 17.05,31 17.05,29.28 17.32,29.01 17.32,27.93 17.72,27.53 17.7,27.51 | 14.04,18.12 14.04,14.79 IC1.2 | 15.89,18.12 v16.02,17.99
SLC_FROM_UC
  Bottom 0.305: U1.28 14.27,25.9 14.27,28.19 14.88,28.19 10K.1
VCC  (via drill 0.35, 0.7)
  Top 0.305: v6.49,22.44 6.49,20.92 1.74,20.92 1.74,17.87 10.71,17.87 v10.71,17.27 | v19.98,29.51 19.24,30.25 18.9,30.25 18.48,30.67 17.9,30.67 17.69,30.46 v15.8,30.46
  Bottom 0.152: U1.6 7.25,22.13 7.28,22.16 | U1.18 6.45,30.81 7.47,31.82 | RED5.1 22.55,25.73 20.61,25.73 IC3.3 21.15,27.14
  Bottom 0.305: U1.4 8.85,22.02 8.71,22.16 7.28,22.16 6.77,22.16 v6.49,22.44 6.75,22.44 6.75,27.3 6.35,27.3 6.35,29.7 U1.18 | U2.2 25.8,24.61 23.67,24.61 RED5.1 | IC3.8 23.15,30.43 21.15,30.43 21.15,29.61 | 21.15,27.14 21.15,29.61 | 6.77,15.46 8.43,15.46 10.25,17.27 v10.71,17.27 10.71,18.07 RED2.1 | 6.77,15.46 5.02,15.46 IC1.20 | 6.77,15.46 6.49,15.74 RED1.2 5.92,16.9 5.02,16.9 1.17,16.9 1.17,4.29 4.22,1.24 25.37,1.24 U2.1 | v19.98,29.51 20.08,29.61 21.15,29.61 | v17.77,32.75 v17.77,32.74 16.59,31.56 16.59,30.8 16.25,30.46 v15.8,30.46 15.1,30.46 14.61,30.95 12.76,30.95 12.73,30.92 9.57,30.92 9.52,30.97 9.52,31.64 9.34,31.82 7.47,31.82
XTAL1
  Bottom 0.305: U1.7 6.45,19.21 IC2.1
XTAL2
  Bottom 0.305: U1.8 5.65,21.17 2.85,21.17 IC2.3

### Text on the board
tNames: IT | IS | HALF | TWENTY | FIVE | QUARTER | TEN | TO | TWELVE | past | ONE | SIX | THREE | FOUR | TWO | FIVE | EIGHT | ELEVEN | SEVEN | NINE | TEN | OCLOCK
bNames: MOSI | MISO | SCK | VCC | RESET | PAST_x | button | SCL | SDA | reset | GND | VCC | reset_IOE | vcc | button | VCC | SCL | 3_x | 1 | 2 | SDA | GND | 3 | GND | 2_x | 5 | 5 | 5 | 4 | R | GND | 6 | - | - | 7 | 8 | GND | 8_x | - | - | GND | 6_x | 1_x | 9_x1 | 7_x | 10_x | VCC